# Altium project SB200BEPCBv2.PrjPCB (part 1 of 2)
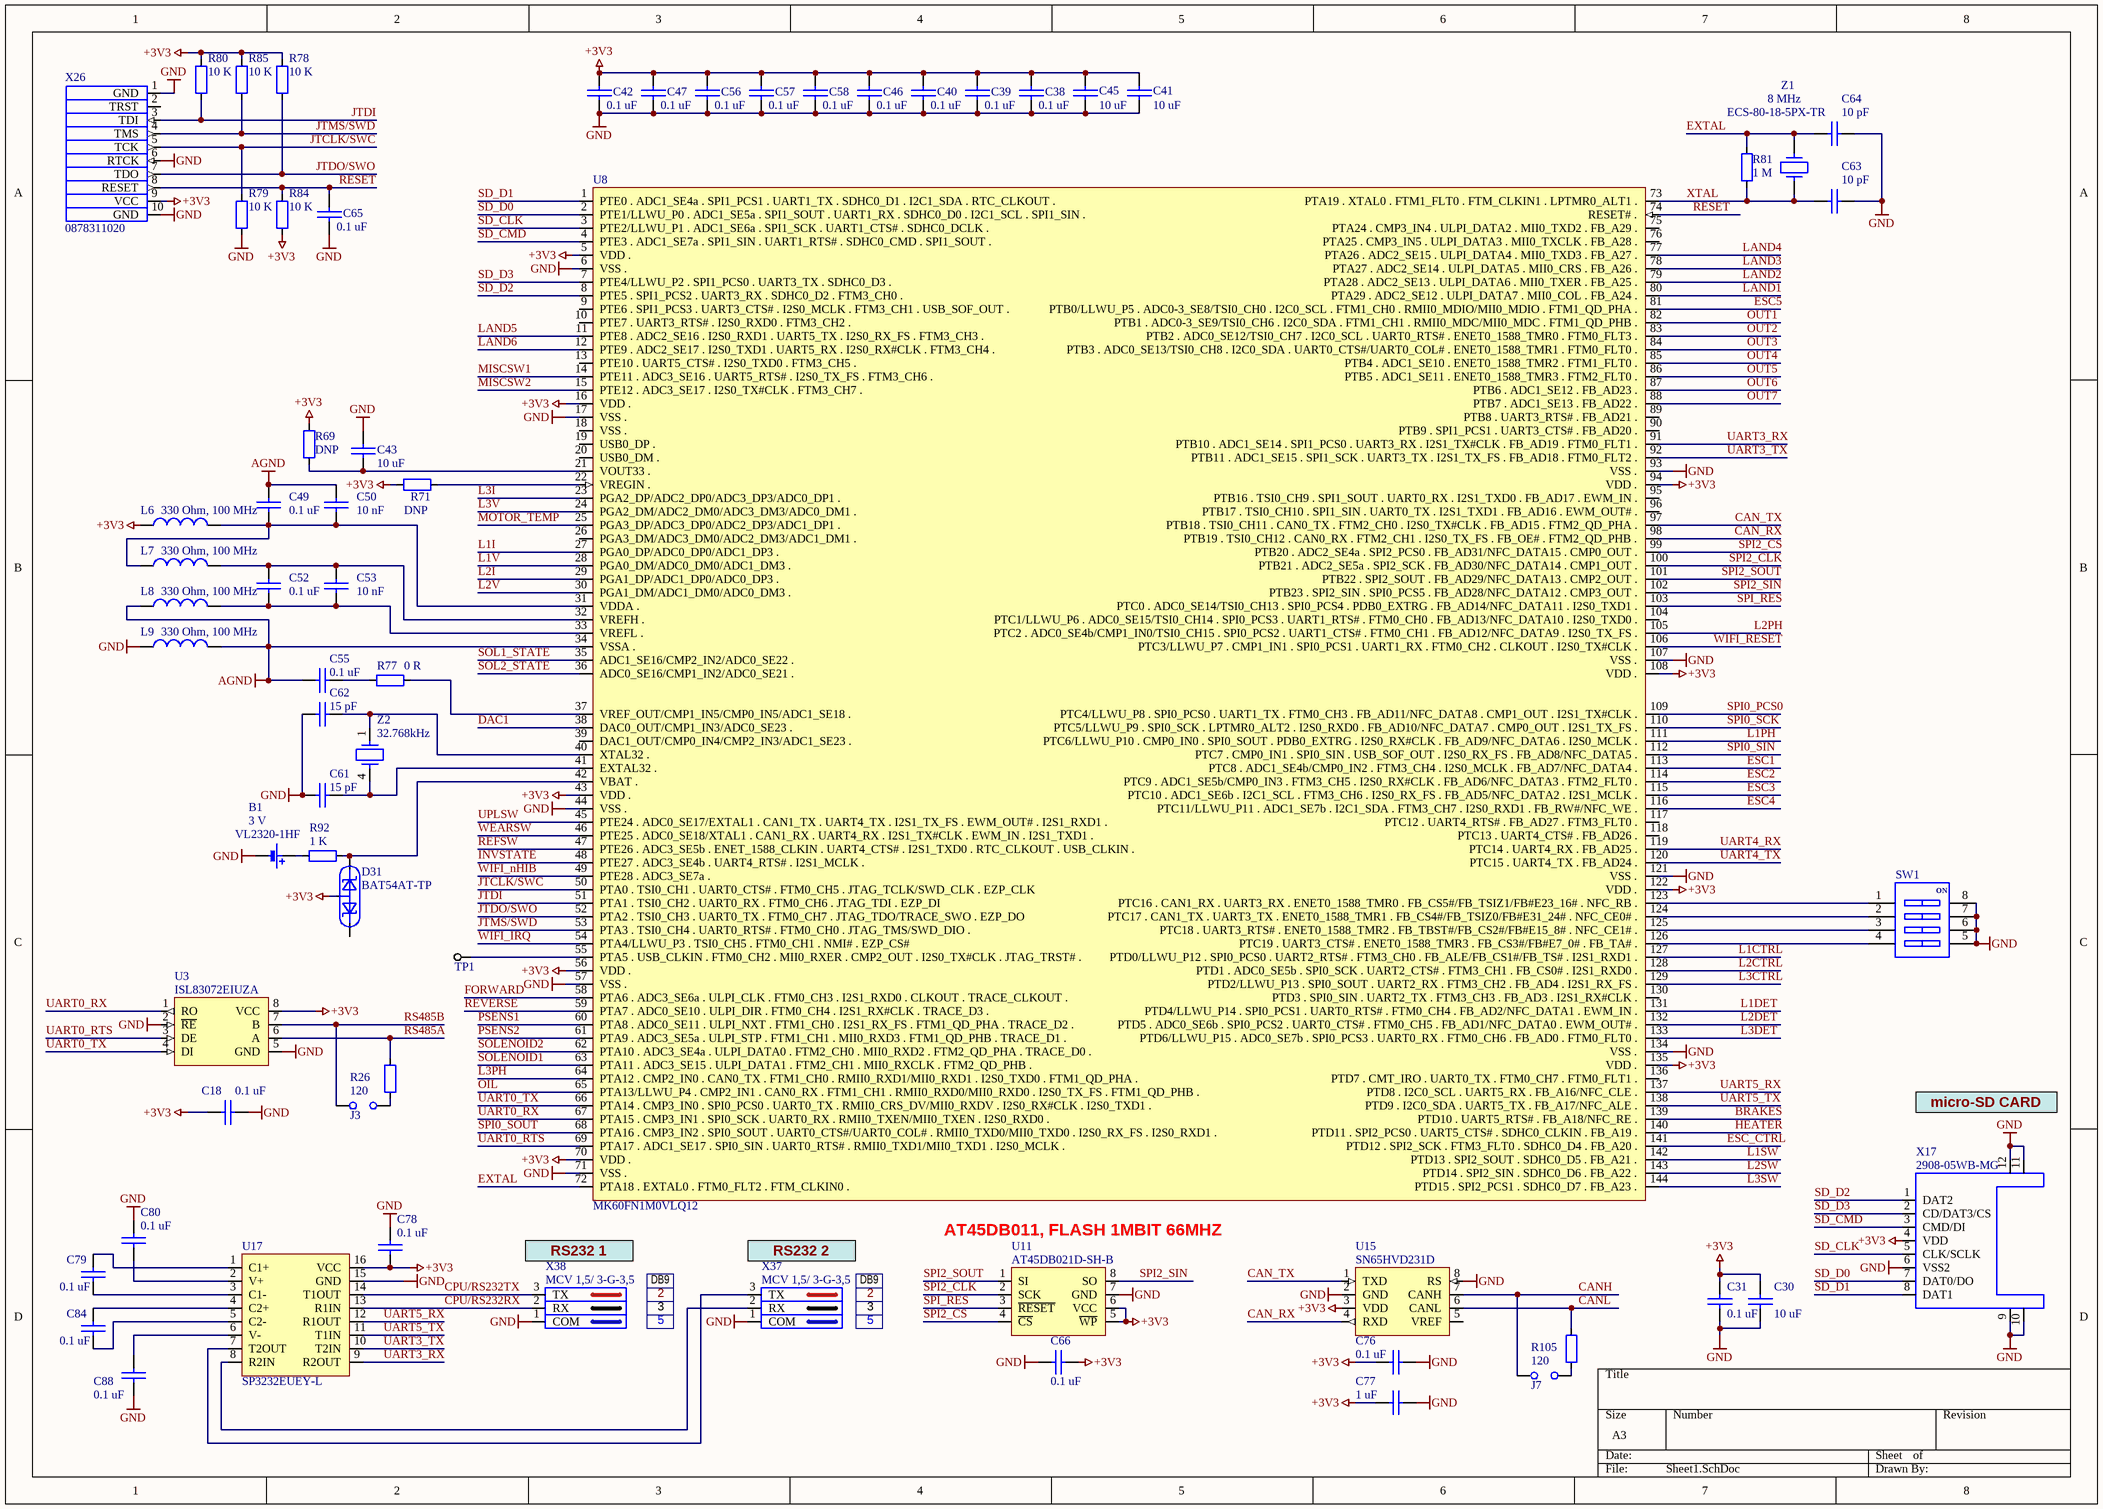
[diagram p0: Sheet1.SchDoc]
5 sheets, 378 parts. Net scope: global (net labels, ports and power ports of the same name join across sheets).
Sheets:
  Sheet1.SchDoc
  Sheet2.SchDoc
  Sheet3.SchDoc
  Sheet4.SchDoc
  Principles_of_control.SchDoc

## Sheet Sheet1.SchDoc
size A3; DocumentNumber: 1; SheetNumber: 1; SheetTotal: 4

### Parts
B1  VL2320-1HF  value 3 V  [SANYO ML2430]
C18  value 0.1 uF  [1608[0603]]  (hidden comment: CVNF100K0603-25)
C30  value 10 uF  [2012[0805]]  (hidden comment: C2012X5R1C106K085AC)
C31  value 0.1 uF  [1608[0603]]  (hidden comment: CL10B104KA8NNND)
C38  value 0.1 uF  [1608[0603]]  (hidden comment: CL10B104KA8NNND)
C39  value 0.1 uF  [1608[0603]]  (hidden comment: CL10B104KA8NNND)
C40  value 0.1 uF  [1608[0603]]  (hidden comment: CL10B104KA8NNND)
C41  value 10 uF  [2012[0805]]  (hidden comment: C2012X5R1C106K085AC)
C42  value 0.1 uF  [1608[0603]]  (hidden comment: CL10B104KA8NNND)
C43  value 10 uF  [2012[0805]]  (hidden comment: C2012X5R1C106K085AC)
C45  value 10 uF  [2012[0805]]  (hidden comment: C2012X5R1C106K085AC)
C46  value 0.1 uF  [1608[0603]]  (hidden comment: CL10B104KA8NNND)
C47  value 0.1 uF  [1608[0603]]  (hidden comment: CL10B104KA8NNND)
C49  value 0.1 uF  [1608[0603]]  (hidden comment: CL10B104KA8NNND)
C50  value 10 nF  [1608[0603]]  (hidden comment: CL10B103JB8NNNC)
C52  value 0.1 uF  [1608[0603]]  (hidden comment: CL10B104KA8NNND)
C53  value 10 nF  [1608[0603]]  (hidden comment: CL10B103JB8NNNC)
C55  value 0.1 uF  [1608[0603]]  (hidden comment: CL10B104KA8NNND)
C56  value 0.1 uF  [1608[0603]]  (hidden comment: CL10B104KA8NNND)
C57  value 0.1 uF  [1608[0603]]  (hidden comment: CL10B104KA8NNND)
C58  value 0.1 uF  [1608[0603]]  (hidden comment: CL10B104KA8NNND)
C61  value 15 pF  [1608[0603]]  (hidden comment: CC0603JRNPO9BN150)
C62  value 15 pF  [1608[0603]]  (hidden comment: CC0603JRNPO9BN150)
C63  value 10 pF  [1608[0603]]  (hidden comment: CCPF010K0603)
C64  value 10 pF  [1608[0603]]  (hidden comment: CCPF010K0603)
C65  value 0.1 uF  [1608[0603]]  (hidden comment: CL10B104KA8NNND)
C66  value 0.1 uF  [1608[0603]]  (hidden comment: CL10B104KA8NNND)
C76  value 0.1 uF  [1608[0603]]  (hidden comment: CVNF100K0603-25)
C77  value 1 uF  [1608[0603]]  (hidden comment: GRM188R60J105KA01D)
C78  value 0.1 uF  [1608[0603]]  (hidden comment: CVNF100K0603-25)
C79  value 0.1 uF  [1608[0603]]  (hidden comment: CVNF100K0603-25)
C80  value 0.1 uF  [1608[0603]]  (hidden comment: CVNF100K0603-25)
C84  value 0.1 uF  [1608[0603]]  (hidden comment: CVNF100K0603-25)
C88  value 0.1 uF  [1608[0603]]  (hidden comment: CVNF100K0603-25)
D31  BAT54AT-TP  [SOT-523F]
J3  PH1-02-TA-HT  [HDR1X2V]  (value not drawn)
J7  PH1-02-TA-HT  [HDR1X2V]  (value not drawn)
L6  value 330 Ohm, 100 MHz  [0603]  (hidden comment: BLM18SG331TN1D)
L7  value 330 Ohm, 100 MHz  [0603]  (hidden comment: BLM18SG331TN1D)
L8  value 330 Ohm, 100 MHz  [0603]  (hidden comment: BLM18SG331TN1D)
L9  value 330 Ohm, 100 MHz  [0603]  (hidden comment: BLM18SG331TN1D)
R26  value 120  [0603]  (hidden comment: RL0603E120-1)
R69  value DNP  [0603]  (hidden comment: DNP_0603)  (no BOM)
R71  value DNP  [0603]  (hidden comment: DNP_0603)  (no BOM)
R77  value 0 R  [0603]  (hidden comment: RC0603JR-070RL)
R78  value 10 K  [0603]  (hidden comment: RL0603K010-1)
R79  value 10 K  [0603]  (hidden comment: RL0603K010-1)
R80  value 10 K  [0603]  (hidden comment: RL0603K010-1)
R81  value 1 M  [0603]  (hidden comment: RC0603FR-071ML)
R84  value 10 K  [0603]  (hidden comment: RL0603K010-1)
R85  value 10 K  [0603]  (hidden comment: RL0603K010-1)
R92  value 1 K  [0603]  (hidden comment: RC0603FR-071KL)
R105  value 120  [0603]  (hidden comment: RL0603E120-1)
SW1  MCDHN-04F-T-V  [MCDHN-04F-T-V]  (value not drawn)
TP1  Test_point 0.7 мм  [Test point 0.7 мм]  (value not drawn)  (net tie, no BOM)
U3  ISL83072EIUZA  [MSOP 8]
U8  MK60FN1M0VLQ12  [LQFP144]
U11  AT45DB021D-SH-B  [SO-8  wide]
U15  SN65HVD231D  [SO-8]
U17  SP3232EUEY-L  [TSOP65P640-16AM]
X17  2908-05WB-MG  [2908-05WB-MG]
X26  0878311020  [878311020 MGRID WALL HDR SMD]
X37  MCV 1,5/ 3-G-3,5  [mcv1.5-3-g_3.5]
X38  MCV 1,5/ 3-G-3,5  [mcv1.5-3-g_3.5]
Z1  ECS-80-18-5PX-TR  value 8 MHz  [Quartz Crystal SMU4]
Z2  value 32.768kHz  [CM200S]  (hidden comment: CM200C32768DZBT)

### Nets
+3V3: C18.1 C30.1 C31.1 C38.2 C39.2 C40.2 C41.1 C42.2 C45.1 C46.2 C47.2 C56.2 C57.2 C58.2 C66.1 C76.1 C77.1 C78.1 D31.3 L6.1 R69.2 R71.1 R78.2 R80.2 R84.1 R85.2 U3.8(VCC) U8.5(VDD_.) U8.16(VDD_.) U8.43(VDD_.) U8.56(VDD_.) U8.70(VDD_.) U8.94(VDD_.) U8.108(VDD_.) U8.122(VDD_.) U8.135(VDD_.) U11.5(~{WP}) U11.6(VCC) U15.3(VDD) U17.16(VCC) X17.4(VDD) X26.9(VCC)
AGND: C49.2 C50.2 C55.2 L8.1 L9.2 U8.34(VSSA_.)
GND: B1.1 C18.2 C30.2 C31.2 C38.1 C39.1 C40.1 C41.2 C42.1 C43.2 C45.2 C46.1 C47.1 C56.1 C57.1 C58.1 C61.2 C62.2 C63.2 C64.2 C65.1 C66.2 C76.2 C77.2 C78.2 C80.1 C88.2 L9.1 R79.1 SW1.5 SW1.6 SW1.7 SW1.8 U3.2(~{RE}) U3.5(GND) U8.6(VSS_.) U8.17(VSS_.) U8.44(VSS_.) U8.57(VSS_.) U8.71(VSS_.) U8.93(VSS_.) U8.107(VSS_.) U8.121(VSS_.) U8.134(VSS_.) U11.7(GND) U15.2(GND) U15.8(RS) U17.15(GND) X17.6(VSS2) X17.9 X17.10(WP) X17.11(GND) X17.12(GND) X26.1(GND) X26.6(RTCK) X26.10(GND) X37.1(COM) X38.1(COM)
BRAKES: U8.139(PTD10_._UART5_RTS#_._FB_A18/NFC_RE_.)
CAN_RX: U8.98(PTB19_._TSI0_CH12_._CAN0_RX_._FTM2_CH1_._I2S0_TX_FS_._FB_OE#_._FTM2_QD_PHB_.) U15.4(RXD)
CAN_TX: U8.97(PTB18_._TSI0_CH11_._CAN0_TX_._FTM2_CH0_._I2S0_TX#CLK_._FB_AD15_._FTM2_QD_PHA_.) U15.1(TXD)
CANH: J7.1 U15.7(CANH)
CANL: R105.2 U15.6(CANL)
CPU/RS232RX: U17.13(R1IN) X38.2(RX)
CPU/RS232TX: U17.14(T1OUT) X38.3(TX)
DAC1: U8.38(DAC0_OUT/CMP1_IN3/ADC0_SE23_.)
ESC1: U8.113(PTC8_._ADC1_SE4b/CMP0_IN2_._FTM3_CH4_._I2S0_MCLK_._FB_AD7/NFC_DATA4_.)
ESC2: U8.114(PTC9_._ADC1_SE5b/CMP0_IN3_._FTM3_CH5_._I2S0_RX#CLK_._FB_AD6/NFC_DATA3_._FTM2_FLT0_.)
ESC3: U8.115(PTC10_._ADC1_SE6b_._I2C1_SCL_._FTM3_CH6_._I2S0_RX_FS_._FB_AD5/NFC_DATA2_._I2S1_MCLK_.)
ESC4: U8.116(PTC11/LLWU_P11_._ADC1_SE7b_._I2C1_SDA_._FTM3_CH7_._I2S0_RXD1_._FB_RW#/NFC_WE_.)
ESC5: U8.81(PTB0/LLWU_P5_._ADC0-3_SE8/TSI0_CH0_._I2C0_SCL_._FTM1_CH0_._RMII0_MDIO/MII0_MDIO_._FTM1_QD_PHA_.)
ESC_CTRL: U8.141(PTD12_._SPI2_SCK_._FTM3_FLT0_._SDHC0_D4_._FB_A20_.)
EXTAL: C64.1 R81.2 U8.72(PTA18_._EXTAL0_._FTM0_FLT2_._FTM_CLKIN0_.) Z1.2
FORWARD: U8.58(PTA6_._ADC3_SE6a_._ULPI_CLK_._FTM0_CH3_._I2S1_RXD0_._CLKOUT_._TRACE_CLKOUT_.)
HEATER: U8.140(PTD11_._SPI2_PCS0_._UART5_CTS#_._SDHC0_CLKIN_._FB_A19_.)
INVSTATE: U8.48(PTE27_._ADC3_SE4b_._UART4_RTS#_._I2S1_MCLK_.)
JTCLK/SWC: R79.2 U8.50(PTA0_._TSI0_CH1_._UART0_CTS#_._FTM0_CH5_._JTAG_TCLK/SWD_CLK_._EZP_CLK) X26.5(TCK)
JTDI: R80.1 U8.51(PTA1_._TSI0_CH2_._UART0_RX_._FTM0_CH6_._JTAG_TDI_._EZP_DI) X26.3(TDI)
JTDO/SWO: R78.1 U8.52(PTA2_._TSI0_CH3_._UART0_TX_._FTM0_CH7_._JTAG_TDO/TRACE_SWO_._EZP_DO) X26.7(TDO)
JTMS/SWD: R85.1 U8.53(PTA3_._TSI0_CH4_._UART0_RTS#_._FTM0_CH0_._JTAG_TMS/SWD_DIO_.) X26.4(TMS)
L1CTRL: U8.127(PTD0/LLWU_P12_._SPI0_PCS0_._UART2_RTS#_._FTM3_CH0_._FB_ALE/FB_CS1#/FB_TS#_._I2S1_RXD1_.)
L1DET: U8.131(PTD4/LLWU_P14_._SPI0_PCS1_._UART0_RTS#_._FTM0_CH4_._FB_AD2/NFC_DATA1_._EWM_IN_.)
L1I: U8.27(PGA0_DP/ADC0_DP0/ADC1_DP3_.)
L1PH: U8.111(PTC6/LLWU_P10_._CMP0_IN0_._SPI0_SOUT_._PDB0_EXTRG_._I2S0_RX#CLK_._FB_AD9/NFC_DATA6_._I2S0_MCLK_.)
L1SW: U8.142(PTD13_._SPI2_SOUT_._SDHC0_D5_._FB_A21_.)
L1V: U8.28(PGA0_DM/ADC0_DM0/ADC1_DM3_.)
L2CTRL: U8.128(PTD1_._ADC0_SE5b_._SPI0_SCK_._UART2_CTS#_._FTM3_CH1_._FB_CS0#_._I2S1_RXD0_.)
L2DET: U8.132(PTD5_._ADC0_SE6b_._SPI0_PCS2_._UART0_CTS#_._FTM0_CH5_._FB_AD1/NFC_DATA0_._EWM_OUT#_.)
L2I: U8.29(PGA1_DP/ADC1_DP0/ADC0_DP3_.)
L2PH: U8.105(PTC2_._ADC0_SE4b/CMP1_IN0/TSI0_CH15_._SPI0_PCS2_._UART1_CTS#_._FTM0_CH1_._FB_AD12/NFC_DATA9_._I2S0_TX_FS_.)
L2SW: U8.143(PTD14_._SPI2_SIN_._SDHC0_D6_._FB_A22_.)
L2V: U8.30(PGA1_DM/ADC1_DM0/ADC0_DM3_.)
L3CTRL: U8.129(PTD2/LLWU_P13_._SPI0_SOUT_._UART2_RX_._FTM3_CH2_._FB_AD4_._I2S1_RX_FS_.)
L3DET: U8.133(PTD6/LLWU_P15_._ADC0_SE7b_._SPI0_PCS3_._UART0_RX_._FTM0_CH6_._FB_AD0_._FTM0_FLT0_.)
L3I: U8.23(PGA2_DP/ADC2_DP0/ADC3_DP3/ADC0_DP1_.)
L3PH: U8.64(PTA12_._CMP2_IN0_._CAN0_TX_._FTM1_CH0_._RMII0_RXD1/MII0_RXD1_._I2S0_TXD0_._FTM1_QD_PHA_.)
L3SW: U8.144(PTD15_._SPI2_PCS1_._SDHC0_D7_._FB_A23_.)
L3V: U8.24(PGA2_DM/ADC2_DM0/ADC3_DM3/ADC0_DM1_.)
LAND1: U8.80(PTA29_._ADC2_SE12_._ULPI_DATA7_._MII0_COL_._FB_A24_.)
LAND2: U8.79(PTA28_._ADC2_SE13_._ULPI_DATA6_._MII0_TXER_._FB_A25_.)
LAND3: U8.78(PTA27_._ADC2_SE14_._ULPI_DATA5_._MII0_CRS_._FB_A26_.)
LAND4: U8.77(PTA26_._ADC2_SE15_._ULPI_DATA4_._MII0_TXD3_._FB_A27_.)
LAND5: U8.11(PTE8_._ADC2_SE16_._I2S0_RXD1_._UART5_TX_._I2S0_RX_FS_._FTM3_CH3_.)
LAND6: U8.12(PTE9_._ADC2_SE17_._I2S0_TXD1_._UART5_RX_._I2S0_RX#CLK_._FTM3_CH4_.)
MISCSW1: U8.14(PTE11_._ADC3_SE16_._UART5_RTS#_._I2S0_TX_FS_._FTM3_CH6_.)
MISCSW2: U8.15(PTE12_._ADC3_SE17_._I2S0_TX#CLK_._FTM3_CH7_.)
MOTOR_TEMP: U8.25(PGA3_DP/ADC3_DP0/ADC2_DP3/ADC1_DP1_.)
OIL: U8.65(PTA13/LLWU_P4_._CMP2_IN1_._CAN0_RX_._FTM1_CH1_._RMII0_RXD0/MII0_RXD0_._I2S0_TX_FS_._FTM1_QD_PHB_.)
OUT1: U8.82(PTB1_._ADC0-3_SE9/TSI0_CH6_._I2C0_SDA_._FTM1_CH1_._RMII0_MDC/MII0_MDC_._FTM1_QD_PHB_.)
OUT2: U8.83(PTB2_._ADC0_SE12/TSI0_CH7_._I2C0_SCL_._UART0_RTS#_._ENET0_1588_TMR0_._FTM0_FLT3_.)
OUT3: U8.84(PTB3_._ADC0_SE13/TSI0_CH8_._I2C0_SDA_._UART0_CTS#/UART0_COL#_._ENET0_1588_TMR1_._FTM0_FLT0_.)
OUT4: U8.85(PTB4_._ADC1_SE10_._ENET0_1588_TMR2_._FTM1_FLT0_.)
OUT5: U8.86(PTB5_._ADC1_SE11_._ENET0_1588_TMR3_._FTM2_FLT0_.)
OUT6: U8.87(PTB6_._ADC1_SE12_._FB_AD23_.)
OUT7: U8.88(PTB7_._ADC1_SE13_._FB_AD22_.)
PSENS1: U8.60(PTA8_._ADC0_SE11_._ULPI_NXT_._FTM1_CH0_._I2S1_RX_FS_._FTM1_QD_PHA_._TRACE_D2_.)
PSENS2: U8.61(PTA9_._ADC3_SE5a_._ULPI_STP_._FTM1_CH1_._MII0_RXD3_._FTM1_QD_PHB_._TRACE_D1_.)
REFSW: U8.47(PTE26_._ADC3_SE5b_._ENET_1588_CLKIN_._UART4_CTS#_._I2S1_TXD0_._RTC_CLKOUT_._USB_CLKIN_.)
RESET: C65.2 R84.2 U8.74(RESET#_.) X26.8(RESET)
REVERSE: U8.59(PTA7_._ADC0_SE10_._ULPI_DIR_._FTM0_CH4_._I2S1_RX#CLK_._TRACE_D3_.)
RS485A: R26.2 U3.6(A)
RS485B: J3.1 U3.7(B)
SD_CLK: U8.3(PTE2/LLWU_P1_._ADC1_SE6a_._SPI1_SCK_._UART1_CTS#_._SDHC0_DCLK_.) X17.5(CLK/SCLK)
SD_CMD: U8.4(PTE3_._ADC1_SE7a_._SPI1_SIN_._UART1_RTS#_._SDHC0_CMD_._SPI1_SOUT_.) X17.3(CMD/DI)
SD_D0: U8.2(PTE1/LLWU_P0_._ADC1_SE5a_._SPI1_SOUT_._UART1_RX_._SDHC0_D0_._I2C1_SCL_._SPI1_SIN_.) X17.7(DAT0/DO)
SD_D1: U8.1(PTE0_._ADC1_SE4a_._SPI1_PCS1_._UART1_TX_._SDHC0_D1_._I2C1_SDA_._RTC_CLKOUT_.) X17.8(DAT1)
SD_D2: U8.8(PTE5_._SPI1_PCS2_._UART3_RX_._SDHC0_D2_._FTM3_CH0_.) X17.1(DAT2)
SD_D3: U8.7(PTE4/LLWU_P2_._SPI1_PCS0_._UART3_TX_._SDHC0_D3_.) X17.2(CD/DAT3/CS)
SOL1_STATE: U8.35(ADC1_SE16/CMP2_IN2/ADC0_SE22_.)
SOL2_STATE: U8.36(ADC0_SE16/CMP1_IN2/ADC0_SE21_.)
SOLENOID1: U8.63(PTA11_._ADC3_SE15_._ULPI_DATA1_._FTM2_CH1_._MII0_RXCLK_._FTM2_QD_PHB_.)
SOLENOID2: U8.62(PTA10_._ADC3_SE4a_._ULPI_DATA0_._FTM2_CH0_._MII0_RXD2_._FTM2_QD_PHA_._TRACE_D0_.)
SPI0_PCS0: U8.109(PTC4/LLWU_P8_._SPI0_PCS0_._UART1_TX_._FTM0_CH3_._FB_AD11/NFC_DATA8_._CMP1_OUT_._I2S1_TX#CLK_.)
SPI0_SCK: U8.110(PTC5/LLWU_P9_._SPI0_SCK_._LPTMR0_ALT2_._I2S0_RXD0_._FB_AD10/NFC_DATA7_._CMP0_OUT_._I2S1_TX_FS_.)
SPI0_SIN: U8.112(PTC7_._CMP0_IN1_._SPI0_SIN_._USB_SOF_OUT_._I2S0_RX_FS_._FB_AD8/NFC_DATA5_.)
SPI0_SOUT: U8.68(PTA16_._CMP3_IN2_._SPI0_SOUT_._UART0_CTS#/UART0_COL#_._RMII0_TXD0/MII0_TXD0_._I2S0_RX_FS_._I2S0_RXD1_.)
SPI2_CLK: U8.100(PTB21_._ADC2_SE5a_._SPI2_SCK_._FB_AD30/NFC_DATA14_._CMP1_OUT_.) U11.2(SCK)
SPI2_CS: U8.99(PTB20_._ADC2_SE4a_._SPI2_PCS0_._FB_AD31/NFC_DATA15_._CMP0_OUT_.) U11.4(~{CS})
SPI2_SIN: U8.102(PTB23_._SPI2_SIN_._SPI0_PCS5_._FB_AD28/NFC_DATA12_._CMP3_OUT_.) U11.8(SO)
SPI2_SOUT: U8.101(PTB22_._SPI2_SOUT_._FB_AD29/NFC_DATA13_._CMP2_OUT_.) U11.1(SI)
SPI_RES: U8.103(PTC0_._ADC0_SE14/TSI0_CH13_._SPI0_PCS4_._PDB0_EXTRG_._FB_AD14/NFC_DATA11_._I2S0_TXD1_.) U11.3(~{RESET})
UART0_RTS: U3.3(DE) U8.69(PTA17_._ADC1_SE17_._SPI0_SIN_._UART0_RTS#_._RMII0_TXD1/MII0_TXD1_._I2S0_MCLK_.)
UART0_RX: U3.1(RO) U8.67(PTA15_._CMP3_IN1_._SPI0_SCK_._UART0_RX_._RMII0_TXEN/MII0_TXEN_._I2S0_RXD0_.)
UART0_TX: U3.4(DI) U8.66(PTA14_._CMP3_IN0_._SPI0_PCS0_._UART0_TX_._RMII0_CRS_DV/MII0_RXDV_._I2S0_RX#CLK_._I2S0_TXD1_.)
UART3_RX: U8.91(PTB10_._ADC1_SE14_._SPI1_PCS0_._UART3_RX_._I2S1_TX#CLK_._FB_AD19_._FTM0_FLT1_.) U17.9(R2OUT)
UART3_TX: U8.92(PTB11_._ADC1_SE15_._SPI1_SCK_._UART3_TX_._I2S1_TX_FS_._FB_AD18_._FTM0_FLT2_.) U17.10(T2IN)
UART4_RX: U8.119(PTC14_._UART4_RX_._FB_AD25_.)
UART4_TX: U8.120(PTC15_._UART4_TX_._FB_AD24_.)
UART5_RX: U8.137(PTD8_._I2C0_SCL_._UART5_RX_._FB_A16/NFC_CLE_.) U17.12(R1OUT)
UART5_TX: U8.138(PTD9_._I2C0_SDA_._UART5_TX_._FB_A17/NFC_ALE_.) U17.11(T1IN)
UPLSW: U8.45(PTE24_._ADC0_SE17/EXTAL1_._CAN1_TX_._UART4_TX_._I2S1_TX_FS_._EWM_OUT#_._I2S1_RXD1_.)
WEARSW: U8.46(PTE25_._ADC0_SE18/XTAL1_._CAN1_RX_._UART4_RX_._I2S1_TX#CLK_._EWM_IN_._I2S1_TXD1_.)
WIFI_IRQ: U8.54(PTA4/LLWU_P3_._TSI0_CH5_._FTM0_CH1_._NMI#_._EZP_CS#)
WIFI_nHIB: U8.49(PTE28_._ADC3_SE7a_.)
WIFI_RESET: U8.106(PTC3/LLWU_P7_._CMP1_IN1_._SPI0_PCS1_._UART1_RX_._FTM0_CH2_._CLKOUT_._I2S0_TX#CLK_.)
XTAL: C63.1 R81.1 U8.73(PTA19_._XTAL0_._FTM1_FLT0_._FTM_CLKIN1_._LPTMR0_ALT1_.) Z1.1
NetB1_2: B1.2 R92.2
NetC43_1: C43.1 R69.1 U8.21(VOUT33_.)
NetC49_1: C49.1 C50.1 L6.2 L7.1 U8.31(VDDA_.)
NetC52_1: C52.1 C53.1 L8.2 U8.33(VREFL_.)
NetC52_2: C52.2 C53.2 L7.2 U8.32(VREFH_.)
NetC55_1: C55.1 R77.1
NetC61_1: C61.1 U8.41(EXTAL32_.) Z2.4
NetC62_1: C62.1 U8.40(XTAL32_.) Z2.1
NetC79_1: C79.1 U17.1(C1+)
NetC79_2: C79.2 U17.3(C1-)
NetC80_2: C80.2 U17.2(V+)
NetC84_1: C84.1 U17.4(C2+)
NetC84_2: C84.2 U17.5(C2-)
NetC88_1: C88.1 U17.6(V-)
NetD31_2: D31.2 R92.1 U8.42(VBAT_.)
NetJ3_2: J3.2 R26.1
NetJ7_2: J7.2 R105.1
NetR71_2: R71.2 U8.22(VREGIN_.)
NetR77_2: R77.2 U8.37(VREF_OUT/CMP1_IN5/CMP0_IN5/ADC1_SE18_.)
NetSW1_1: SW1.1 U8.123(PTC16_._CAN1_RX_._UART3_RX_._ENET0_1588_TMR0_._FB_CS5#/FB_TSIZ1/FB#E23_16#_._NFC_RB_.)
NetSW1_2: SW1.2 U8.124(PTC17_._CAN1_TX_._UART3_TX_._ENET0_1588_TMR1_._FB_CS4#/FB_TSIZ0/FB#E31_24#_._NFC_CE0#_.)
NetSW1_3: SW1.3 U8.125(PTC18_._UART3_RTS#_._ENET0_1588_TMR2_._FB_TBST#/FB_CS2#/FB#E15_8#_._NFC_CE1#_.)
NetSW1_4: SW1.4 U8.126(PTC19_._UART3_CTS#_._ENET0_1588_TMR3_._FB_CS3#/FB#E7_0#_._FB_TA#_.)
NetTP1_1: TP1.1 U8.55(PTA5_._USB_CLKIN_._FTM0_CH2_._MII0_RXER_._CMP2_OUT_._I2S0_TX#CLK_._JTAG_TRST#_.)
NetU17_7: U17.7(T2OUT) X37.3(TX)
NetU17_8: U17.8(R2IN) X37.2(RX)

Not connected (* = marked no-connect by the designer): D31 1; U8 9(PTE6_._SPI1_PCS3_._UART3_CTS#_._I2S0_MCLK_._FTM3_CH1_._USB_SOF_OUT_.) 10(PTE7_._UART3_RTS#_._I2S0_RXD0_._FTM3_CH2_.) 13(PTE10_._UART5_CTS#_._I2S0_TXD0_._FTM3_CH5_.) 18(VSS_.) 19(USB0_DP_.) 20(USB0_DM_.) 26(PGA3_DM/ADC3_DM0/ADC2_DM3/ADC1_DM1_.) 39(DAC1_OUT/CMP0_IN4/CMP2_IN3/ADC1_SE23_.) 75(PTA24_._CMP3_IN4_._ULPI_DATA2_._MII0_TXD2_._FB_A29_.) 76(PTA25_._CMP3_IN5_._ULPI_DATA3_._MII0_TXCLK_._FB_A28_.) 89(PTB8_._UART3_RTS#_._FB_AD21_.) 90(PTB9_._SPI1_PCS1_._UART3_CTS#_._FB_AD20_.) 95(PTB16_._TSI0_CH9_._SPI1_SOUT_._UART0_RX_._I2S1_TXD0_._FB_AD17_._EWM_IN_.) 96(PTB17_._TSI0_CH10_._SPI1_SIN_._UART0_TX_._I2S1_TXD1_._FB_AD16_._EWM_OUT#_.) 104(PTC1/LLWU_P6_._ADC0_SE15/TSI0_CH14_._SPI0_PCS3_._UART1_RTS#_._FTM0_CH0_._FB_AD13/NFC_DATA10_._I2S0_TXD0_.) 117(PTC12_._UART4_RTS#_._FB_AD27_._FTM3_FLT0_.) 118(PTC13_._UART4_CTS#_._FB_AD26_.) 130(PTD3_._SPI0_SIN_._UART2_TX_._FTM3_CH3_._FB_AD3_._I2S1_RX#CLK_.) 136(PTD7_._CMT_IRO_._UART0_TX_._FTM0_CH7_._FTM0_FLT1_.); U15 5(VREF); X26 2(TRST)

### Notes on the sheet
- micro-SD CARD
- RS232 1
- RS232 2
- AT45DB011, FLASH 1MBIT 66MHZ
- DB9
- 2
- 3
- 5
- (in symbol MCDHN-04F-T-V) ON

### Library data of the parts
B1 = VL2320-1HF: Rechargeable Litium battery, Sanyo, 100 mAh, 3.1 V; PartNum: P083-ND; Manufacturer: Panasonic - BSG; Price: 5.85$; Distributor: Digi-Key; PartName: VL2320-1HF
C18 C76 C78-C80 C84 C88 = CVNF100K0603-25: 0.1 uF, 25V, 10% , X7R,  0603 SMD MLC Capacitor; Manufacturer: SAMSUNG; PartNum: CL10B104KA8NNND; Tolerance: 10%; Distributor: Future; Price: 0.0026 Euro; Voltage: 25 V; PartName: CL10B104KA8NNND
C30 C41 C43 C45 = C2012X5R1C106K/0.85: 10 uF, 16V, X5R, ±10%, 0805; Manufacturer: TDK Corporation; Distributor: Future; Price: 0.0347 Euro; Tolerance: ±10%; PartNum: C2012X5R1C106K085AC; Voltage: 16V; PartName: C2012X5R1C106K085AC
C31 C38-C40 C42 C46 C47 C49 C52 C55-C58 C65 C66 = CVNF100K0603-25: 0.1 uF, 25V, 10% , X7R,  0603 SMD MLC Capacitor; Manufacturer: SAMSUNG; Tolerance: 10%; Distributor: Future; Price: 0.0026 Euro; Voltage: 25 V; PartNum: CL10B104KA8NNND; PartName: CL10B104KA8NNND
C50 C53 = CVNF010K0603: 10 nF, 50V, 5%, X7R, 0603 SMD MLC Capacitor; Manufacturer: SAMSUNG; Tolerance: 5%; Distributor: Future; Price: 0.0045 Euro; PartNum: CL10B103JB8NNNC; Voltage: 50 V; PartName: CL10B103JB8NNNC
C61 C62 = CCPF015K0603: 15 pF, 50V, 5%, NP0, 0603 SMD MLC Capacitor; Manufacturer: YAGEO AMERICA CORPORATION; Tolerance: 5%; Price: 0.003$; Distributor: Future; PartNum: CC0603JRNPO9BN150; Voltage: 50 V; PartName: CC0603JRNPO9BN150
C63 C64 = CCPF010K0603: 10 pF, 50V, 5%, NP0, 0603 SMD MLC Capacitor; Manufacturer: Kemet; PartNum: 399-1049-1-ND; PartName: C0603C100J5GACTU; Tolerance: 5%; Price: 0.0075$; Distributor: Digi-Key; Voltage: 50 V
C77 = GRM188R60J105KA01D: 1.0 uF, 6.3V, 10%, X5R, 0603; Manufacturer: Murata Electronics North America; PartNum: 490-1550-1-ND; Tolerance: +-10%; Distributor: DigiKey; Price: 0.023$; Voltage: 6.3 V; PartName: GRM188R60J105KA01D
D31 = BAT54AT-TP: Schottky Diode, 30 V, 200 mA, common anode, SOT523; Manufacturer: Micro Commercial Co; PartNum: BAT54AT-TPDKR-ND; Distributor: Digi-Key; Price: 0.52$; PartName: BAT54AT-TP
J3 J7 = Jumper: 2 Pos. 2.54 mm Single Row Through Hole Straight Pin Header; Manufacturer: ADAM TECH; Distributor: Future; Price: 0.02 Euro; PartNum: PH1-02-TA-HT; PartName: PH1-02-TA-HT
L6-L9 = BLM18SG331TN1D: Ferrite bead, 330 Ohm, 100 MHz,  1.5 A, 0.07 Ohm; Manufacturer: Murata Electronics North America; Tolerance: 25%; Distributor: Future; Price: 0.03 Euro; PartNum: BLM18SG331TN1D; PartName: BLM18SG331TN1D
R26 R105 = RL0603E120-1: 120 R, 1%, 0603, SMD Resistor, Taped; Manufacturer: Vishay; Voltage: 75 V; Distributor: Schukat; Price: 0.002 Euro; Tolerance: 1%; PartNum: RL0603E120-1; PartName: RL0603E120-1
R69 R71 = DNP_0603: DNP, 0603; PartNum: DNP; PartName: DNP
R77 = RL0603E000: 0 R, 5%, 0603, SMD Resistor, Taped; Manufacturer: YAGEO AMERICA CORPORATION; Voltage: 75 V; Distributor: Future; Price: 0.0017$; Tolerance: 5%; PartNum: RC0603JR-070RL; PartName: RC0603JR-070RL
R78-R80 R84 R85 = RL0603K010-1: 10 K, 1%, 0603, SMD Resistor, Taped; Manufacturer: Vishay Dale; PartNum: 541-10KGCT-ND; PartName: CRCW060310K0JNEA; Voltage: 75 V; Distributor: Digi-Key; Price: 0.016$; Tolerance: 1%
R81 = RC0603FR-071ML: 1 M, 1%, 0603, SMD Resistor, Taped; Manufacturer: YAGEO AMERICA CORPORATION; Voltage: 75 V; Distributor: Future; Price: 0.002 Euro; Tolerance: 1%; PartNum: RC0603FR-071ML; PartName: RC0603FR-071ML
R92 = RL0603K001-1: 1 K, 1%, 0603, SMD Resistor, Taped; Manufacturer: YAGEO AMERICA CORPORATION; Voltage: 75 V; Distributor: Future; Price: 0.0017$; Tolerance: 1%; PartNum: RC0603FR-071KL; PartName: RC0603FR-071KL
SW1 = MCDHN-04F-T-V: SWITCH, DIP, SMD, 4 WAY, 1.27mm; Manufacturer: MULTICOMP; PartNum: 1605479; Distributor: Farnell; Price: 0.69 Euro; PartName: 1605479
U3 = ISL3178EIUZ: RS485/422 Transc. 3..3.6V  , -40..+85 C,10-MSOP; Manufacturer: Intersil; PartNum: ISL83072EIUZA-TCT-ND; Price: 1.83$; Distributor: Digi-Key; PartName: ISL83072EIUZA
U8 = MK60FN1M0VLQ12: MK60 Series 32 Bit 1 MB Flash 128 KB Ram 120 Mhz Microcontroller - LQFP-144; Manufacturer: Freescale; Distributor: Future; PartNum: MK60FN1M0VLQ12; Price: 8.45 Euro; PartName: MK60FN1M0VLQ12
U11 = AT45DB011D-SH-T: IC DATAFLASH 1MBIT 2.7 V ~ 3.6 V 8-SOIC; Manufacturer: Adesto Technologies; PartNum: 1265-1033-1-ND; Price: 0.8$; Distributor: Digi-Key; PartName: AT45DB021D-SH-B
U15 = SN65HVD231D: 3.3-V CAN TRANSCEIVERS SO-8; Manufacturer: Texas Instruments; PartNum: 296-12206-5-ND; Price: 4.2$; Distributor: Digi-Key; PartName: SN65HVD231D
U17 = SP3232EUEY-L: IC TXRX RS232 ESD TRUE, 1 Mbps, -40+85C, 16TSSOP; Manufacturer: Exar Corporation; PartNum: 1016-1510-5-ND; Distributor: Digi-Key; Price: 1.5$; PartName: SP3232EUEY-L
X17 = 2908-05WB-MG: microSD cadr holder; Manufacturer: Amphenol Commercial Products; PartNum: 101-00660-68-6-1-ND; PartName: 101-00660-68-6; Price: 1.97$; Distributor: Digi-Key
X26 = 0878321020: JTAG, CONN HEADER 10POS 2MM VERT SMD; Manufacturer: Molex Inc; PartNum: WM18639-ND; Distributor: Digi-Key; Price: 1.29$; PartName: 0878321020
X37 X38 = MCV1.5/3-G-3.5: Header, 8 A, 160 V, 3.5 mm pitch, 3 pos; Manufacturer: Phoenix Contact; PartNum: 1843619; Distributor: Phoenix Contact; Price: 0.32 Euro; PartName: MCV 1,5/ 3-G-3,5
Z1 = ECS-80-18-5PX-TR: 8 MHz, CSM-7 Case Series, SMD, Low Profile, Load Capacitance 18pF  ,Operating Temperature -10°C ~ 70°C; Manufacturer: ECS Inc.; PartNum: XC1271CT-ND; Distributor: Digi-Key; Price: 0.61$; PartName: ECS-80-18-5PX-TR
Z2 = MC306-32,768: Crystal 32.768 kHz ±20 ppm 6 pF -40 to +85 °C SMT Tuning Fork Crystal; Manufacturer: CITIZEN FINETECH MIYOTA; Tolerance: 20 ppm; PartNum: CM200C32768DZBT; Price: 0.1956 Euro; Distributor: Future; PartName: CM200C32768DZBT

## Sheet Sheet2.SchDoc
size A3; DocumentNumber: 2; SheetNumber: 2; SheetTotal: 4
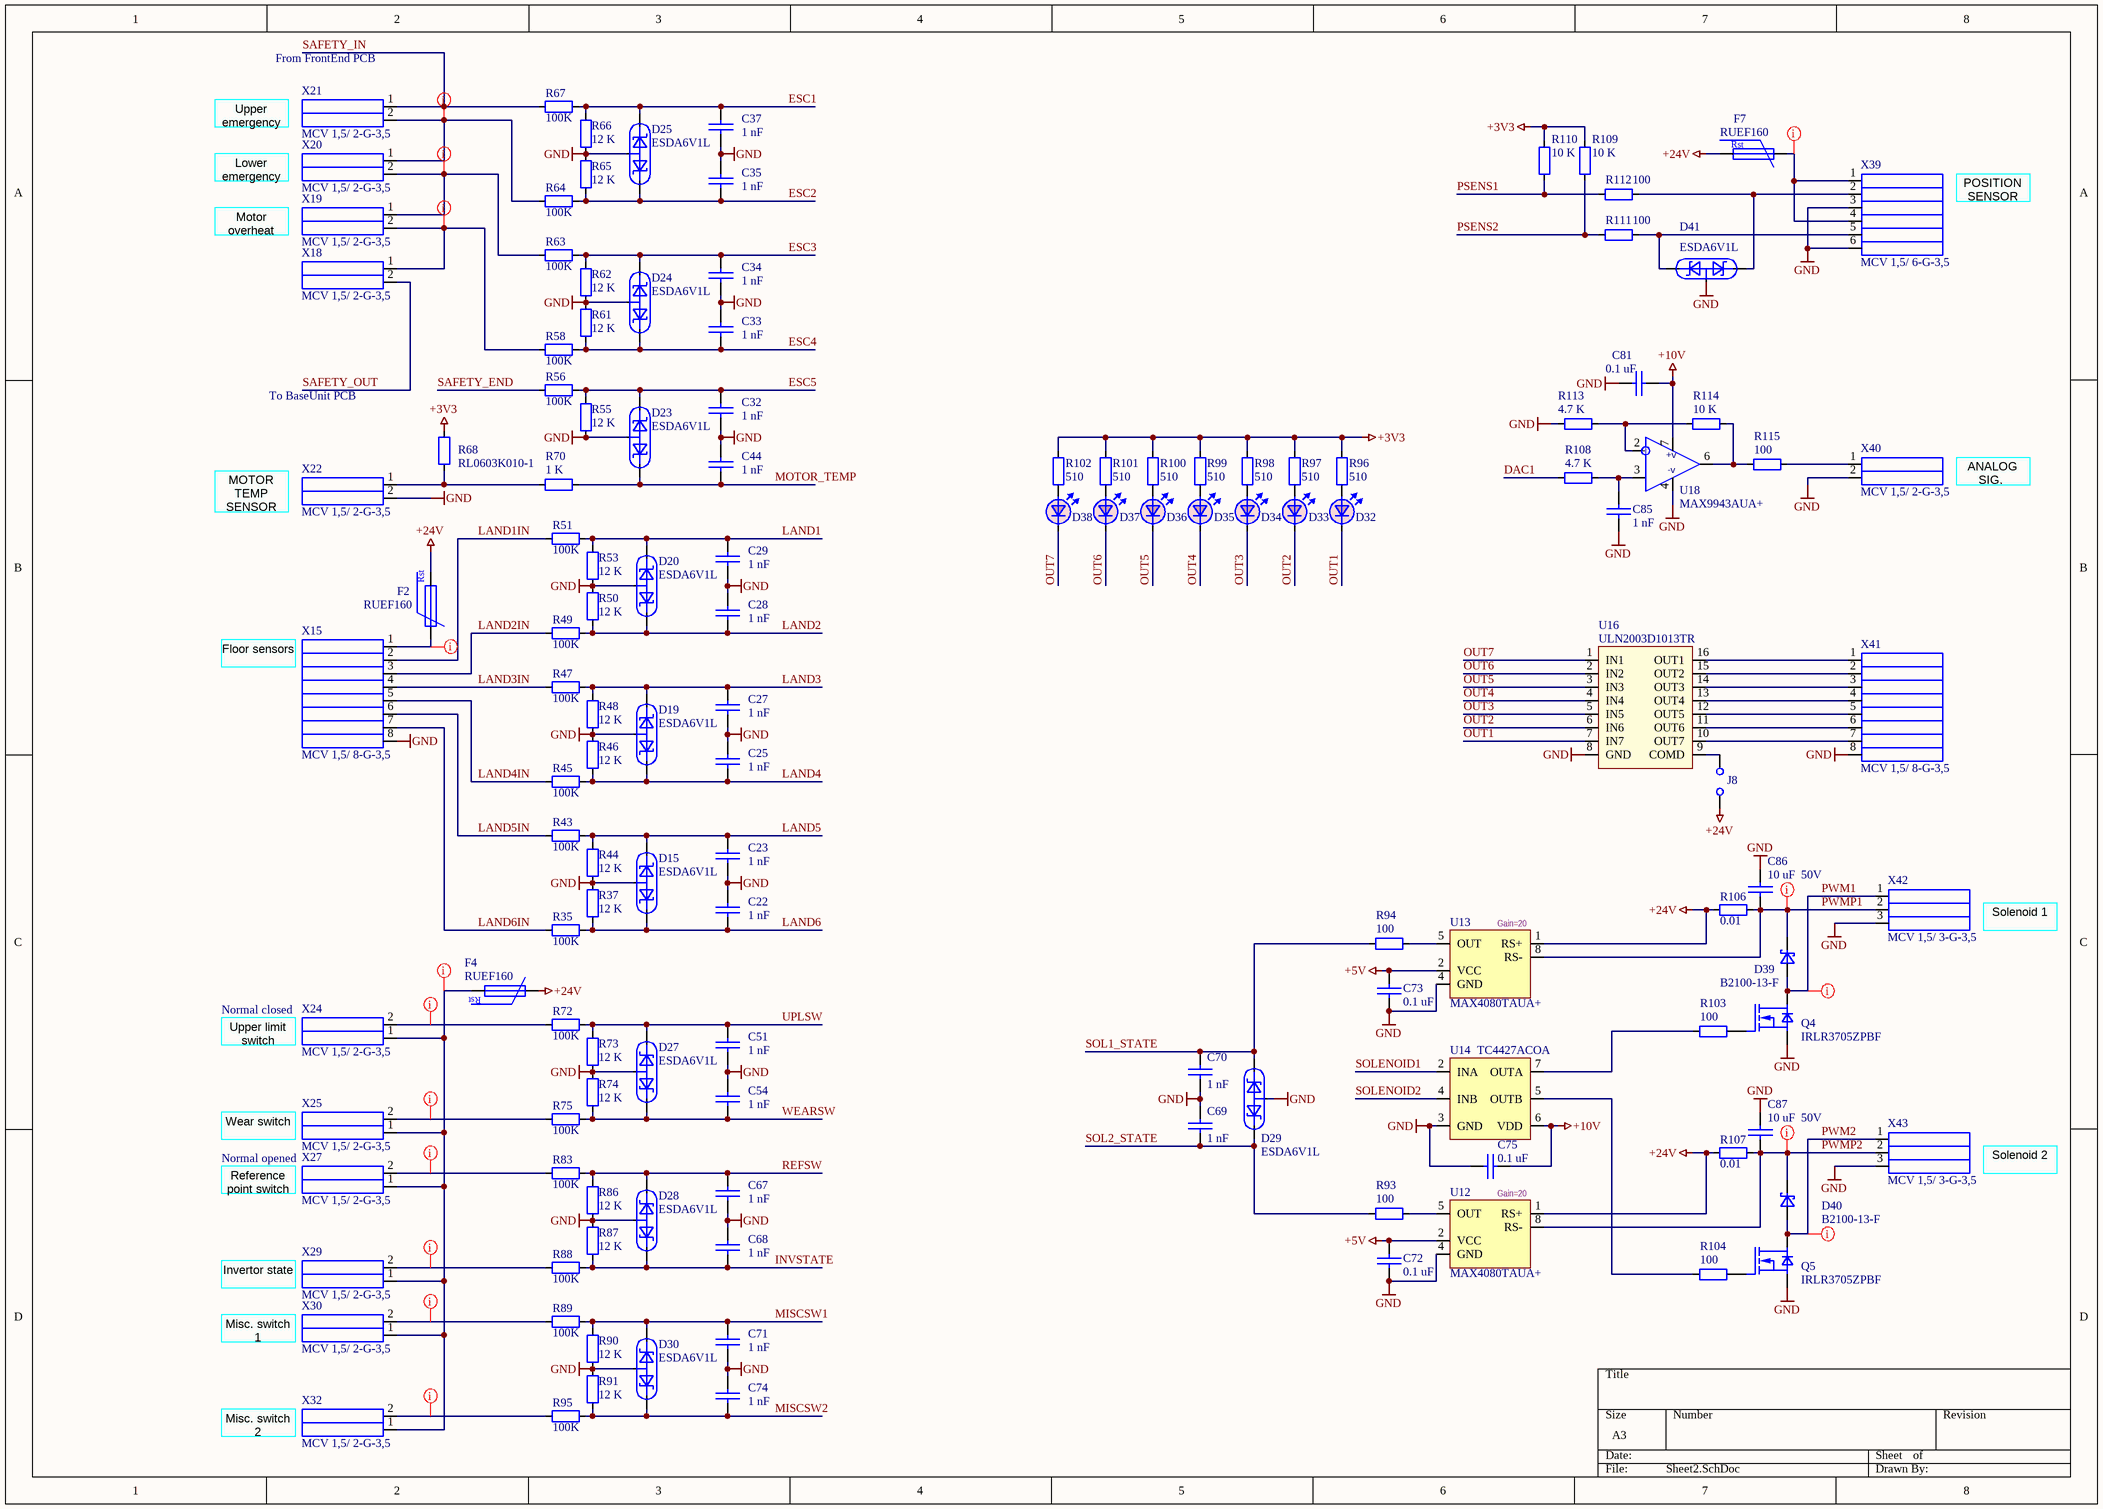
[diagram p1: Sheet2.SchDoc]

### Parts
C22  value 1 nF  [1608[0603]]  (hidden comment: CVNF1.0K0603)
C23  value 1 nF  [1608[0603]]  (hidden comment: CVNF1.0K0603)
C25  value 1 nF  [1608[0603]]  (hidden comment: CVNF1.0K0603)
C27  value 1 nF  [1608[0603]]  (hidden comment: CVNF1.0K0603)
C28  value 1 nF  [1608[0603]]  (hidden comment: CVNF1.0K0603)
C29  value 1 nF  [1608[0603]]  (hidden comment: CVNF1.0K0603)
C32  value 1 nF  [1608[0603]]  (hidden comment: CVNF1.0K0603)
C33  value 1 nF  [1608[0603]]  (hidden comment: CVNF1.0K0603)
C34  value 1 nF  [1608[0603]]  (hidden comment: CVNF1.0K0603)
C35  value 1 nF  [1608[0603]]  (hidden comment: CVNF1.0K0603)
C37  value 1 nF  [1608[0603]]  (hidden comment: CVNF1.0K0603)
C44  value 1 nF  [1608[0603]]  (hidden comment: CVNF1.0K0603)
C51  value 1 nF  [1608[0603]]  (hidden comment: CVNF1.0K0603)
C54  value 1 nF  [1608[0603]]  (hidden comment: CVNF1.0K0603)
C67  value 1 nF  [1608[0603]]  (hidden comment: CVNF1.0K0603)
C68  value 1 nF  [1608[0603]]  (hidden comment: CVNF1.0K0603)
C69  value 1 nF  [1608[0603]]  (hidden comment: CVNF1.0K0603)
C70  value 1 nF  [1608[0603]]  (hidden comment: CVNF1.0K0603)
C71  value 1 nF  [1608[0603]]  (hidden comment: CVNF1.0K0603)
C72  value 0.1 uF  [1608[0603]]  (hidden comment: CVNF100K0603-25)
C73  value 0.1 uF  [1608[0603]]  (hidden comment: CVNF100K0603-25)
C74  value 1 nF  [1608[0603]]  (hidden comment: CVNF1.0K0603)
C75  value 0.1 uF  [1608[0603]]  (hidden comment: CVNF100K0603-25)
C81  value 0.1 uF  [1608[0603]]  (hidden comment: CVNF100K0603-25)
C85  value 1 nF  [1608[0603]]  (hidden comment: CVNF1.0K0603)
C86  value 10 uF  Voltage: 50V  [3225[1210]]  (hidden comment: GRM32DF51H106ZA01L)
C87  value 10 uF  Voltage: 50V  [3225[1210]]  (hidden comment: GRM32DF51H106ZA01L)
D15  ESDA6V1L  [SOT23]
D19  ESDA6V1L  [SOT23]
D20  ESDA6V1L  [SOT23]
D23  ESDA6V1L  [SOT23]
D24  ESDA6V1L  [SOT23]
D25  ESDA6V1L  [SOT23]
D27  ESDA6V1L  [SOT23]
D28  ESDA6V1L  [SOT23]
D29  ESDA6V1L  [SOT23]
D30  ESDA6V1L  [SOT23]
D32  SML-211UTT86  [0805 LED]  (value not drawn)
D33  SML-211UTT86  [0805 LED]  (value not drawn)
D34  SML-211UTT86  [0805 LED]  (value not drawn)
D35  SML-211UTT86  [0805 LED]  (value not drawn)
D36  SML-211UTT86  [0805 LED]  (value not drawn)
D37  SML-211UTT86  [0805 LED]  (value not drawn)
D38  SML-211UTT86  [0805 LED]  (value not drawn)
D39  B2100-13-F  [SMB ST]
D40  B2100-13-F  [SMB ST]
D41  ESDA6V1L  [SOT23]
F2  RUEF160  [RUE160]
F4  RUEF160  [RUE160]
F7  RUEF160  [RUE160]
J8  PH1-02-TA-HT  [HDR1X2V]  (value not drawn)
Q4  IRLR3705ZPBF  [DPAK TO-252]
Q5  IRLR3705ZPBF  [DPAK TO-252]
R35  value 100K  [3216[1206]]  (hidden comment: ERJ-8ENF1003V)
R37  value 12 K  [0603]  (hidden comment: RL0603K012-1)
R43  value 100K  [3216[1206]]  (hidden comment: ERJ-8ENF1003V)
R44  value 12 K  [0603]  (hidden comment: RL0603K012-1)
R45  value 100K  [3216[1206]]  (hidden comment: ERJ-8ENF1003V)
R46  value 12 K  [0603]  (hidden comment: RL0603K012-1)
R47  value 100K  [3216[1206]]  (hidden comment: ERJ-8ENF1003V)
R48  value 12 K  [0603]  (hidden comment: RL0603K012-1)
R49  value 100K  [3216[1206]]  (hidden comment: ERJ-8ENF1003V)
R50  value 12 K  [0603]  (hidden comment: RL0603K012-1)
R51  value 100K  [3216[1206]]  (hidden comment: ERJ-8ENF1003V)
R53  value 12 K  [0603]  (hidden comment: RL0603K012-1)
R55  value 12 K  [0603]  (hidden comment: RL0603K012-1)
R56  value 100K  [3216[1206]]  (hidden comment: ERJ-8ENF1003V)
R58  value 100K  [3216[1206]]  (hidden comment: ERJ-8ENF1003V)
R61  value 12 K  [0603]  (hidden comment: RL0603K012-1)
R62  value 12 K  [0603]  (hidden comment: RL0603K012-1)
R63  value 100K  [3216[1206]]  (hidden comment: ERJ-8ENF1003V)
R64  value 100K  [3216[1206]]  (hidden comment: ERJ-8ENF1003V)
R65  value 12 K  [0603]  (hidden comment: RL0603K012-1)
R66  value 12 K  [0603]  (hidden comment: RL0603K012-1)
R67  value 100K  [3216[1206]]  (hidden comment: ERJ-8ENF1003V)
R68  RL0603K010-1  [0603]
R70  value 1 K  [0603]  (hidden comment: RC0603FR-071KL)
R72  value 100K  [3216[1206]]  (hidden comment: ERJ-8ENF1003V)
R73  value 12 K  [0603]  (hidden comment: RL0603K012-1)
R74  value 12 K  [0603]  (hidden comment: RL0603K012-1)
R75  value 100K  [3216[1206]]  (hidden comment: ERJ-8ENF1003V)
R83  value 100K  [3216[1206]]  (hidden comment: ERJ-8ENF1003V)
R86  value 12 K  [0603]  (hidden comment: RL0603K012-1)
R87  value 12 K  [0603]  (hidden comment: RL0603K012-1)
R88  value 100K  [3216[1206]]  (hidden comment: ERJ-8ENF1003V)
R89  value 100K  [3216[1206]]  (hidden comment: ERJ-8ENF1003V)
R90  value 12 K  [0603]  (hidden comment: RL0603K012-1)
R91  value 12 K  [0603]  (hidden comment: RL0603K012-1)
R93  value 100  [0603]  (hidden comment: ERJ-3EKF1000V)
R94  value 100  [0603]  (hidden comment: ERJ-3EKF1000V)
R95  value 100K  [3216[1206]]  (hidden comment: ERJ-8ENF1003V)
R96  value 510  [0603]  (hidden comment: RL0603E510-1)
R97  value 510  [0603]  (hidden comment: RL0603E510-1)
R98  value 510  [0603]  (hidden comment: RL0603E510-1)
R99  value 510  [0603]  (hidden comment: RL0603E510-1)
R100  value 510  [0603]  (hidden comment: RL0603E510-1)
R101  value 510  [0603]  (hidden comment: RL0603E510-1)
R102  value 510  [0603]  (hidden comment: RL0603E510-1)
R103  value 100  [0603]  (hidden comment: ERJ-3EKF1000V)
R104  value 100  [0603]  (hidden comment: ERJ-3EKF1000V)
R106  value 0.01  [MCS3264]  (hidden comment: MCS3264R010FER)
R107  value 0.01  [MCS3264]  (hidden comment: MCS3264R010FER)
R108  value 4.7 K  [0603]  (hidden comment: RL0603K004.7-1)
R109  value 10 K  [0603]  (hidden comment: RL0603K010-1)
R110  value 10 K  [0603]  (hidden comment: RL0603K010-1)
R111  value 100  [0603]  (hidden comment: ERJ-3EKF1000V)
R112  value 100  [0603]  (hidden comment: ERJ-3EKF1000V)
R113  value 4.7 K  [0603]  (hidden comment: RL0603K004.7-1)
R114  value 10 K  [0603]  (hidden comment: RL0603K010-1)
R115  value 100  [0603]  (hidden comment: ERJ-3EKF1000V)
U12  MAX4080TAUA+  [MSOP 8]
U13  MAX4080TAUA+  [MSOP 8]
U14  TC4427ACOA  [SO-8]
U16  ULN2003D1013TR  [SO-16]
U18  MAX9943AUA+  [TSSOP-8]
X15  MCV 1,5/ 8-G-3,5  [mcv1.5-8-g_3.5]
X18  MCV 1,5/ 2-G-3,5  [mcv1.5-2-g_3.5]
X19  MCV 1,5/ 2-G-3,5  [mcv1.5-2-g_3.5]
X20  MCV 1,5/ 2-G-3,5  [mcv1.5-2-g_3.5]
X21  MCV 1,5/ 2-G-3,5  [mcv1.5-2-g_3.5]
X22  MCV 1,5/ 2-G-3,5  [mcv1.5-2-g_3.5]
X24  MCV 1,5/ 2-G-3,5  [mcv1.5-2-g_3.5]
X25  MCV 1,5/ 2-G-3,5  [mcv1.5-2-g_3.5]
X27  MCV 1,5/ 2-G-3,5  [mcv1.5-2-g_3.5]
X29  MCV 1,5/ 2-G-3,5  [mcv1.5-2-g_3.5]
X30  MCV 1,5/ 2-G-3,5  [mcv1.5-2-g_3.5]
X32  MCV 1,5/ 2-G-3,5  [mcv1.5-2-g_3.5]
X39  MCV 1,5/ 6-G-3,5  [mcv1.5-6-g_3.5]
X40  MCV 1,5/ 2-G-3,5  [mcv1.5-2-g_3.5]
X41  MCV 1,5/ 8-G-3,5  [mcv1.5-8-g_3.5]
X42  MCV 1,5/ 3-G-3,5  [mcv1.5-3-g_3.5]
X43  MCV 1,5/ 3-G-3,5  [mcv1.5-3-g_3.5]

### Nets
+3V3: R68.1 R96.2 R97.2 R98.2 R99.2 R100.2 R101.2 R102.2 R109.2 R110.2
+5V: C72.2 C73.2 U12.2(VCC) U13.2(VCC)
+10V: C75.2 C81.2 U14.6(VDD) U18.7(V+)
+24V: F2.2 F4.1 F7.2 J8.1 R106.2 R107.2 U12.1(RS+) U13.1(RS+)
GND: C22.1 C23.2 C25.1 C27.2 C28.1 C29.2 C32.2 C33.1 C34.2 C35.1 C37.2 C44.1 C51.2 C54.1 C67.2 C68.1 C69.1 C70.2 C71.2 C72.1 C73.1 C74.1 C75.1 C81.1 C85.2 C86.1 C87.1 D15.3 D19.3 D20.3 D23.3 D24.3 D25.3 D27.3 D28.3 D29.3 D30.3 D41.3 Q4.3(S) Q5.3(S) R37.2 R44.1 R46.2 R48.1 R50.2 R53.1 R55.1 R61.2 R62.1 R65.2 R66.1 R73.1 R74.2 R86.1 R87.2 R90.1 R91.2 R113.2 U12.4(GND) U13.4(GND) U14.3(GND) U16.8(GND) U18.4(GND) X15.8 X22.2 X39.3 X39.6 X40.2 X41.8 X42.3(-) X43.3(-)
DAC1: R108.2
ESC1: C37.1 D25.2 R66.2 R67.2
ESC2: C35.2 D25.1 R64.2 R65.1
ESC3: C34.1 D24.2 R62.2 R63.2
ESC4: C33.2 D24.1 R58.2 R61.1
ESC5: C32.1 D23.2 R55.2 R56.2
INVSTATE: C68.2 D28.2 R87.1 R88.2
LAND1: C29.1 D20.2 R51.2 R53.2
LAND1IN: R51.1 X15.2
LAND2: C28.2 D20.1 R49.2 R50.1
LAND2IN: R49.1 X15.3
LAND3: C27.1 D19.2 R47.2 R48.2
LAND3IN: R47.1 X15.4
LAND4: C25.2 D19.1 R45.2 R46.1
LAND4IN: R45.1 X15.5
LAND5: C23.1 D15.2 R43.2 R44.2
LAND5IN: R43.1 X15.6
LAND6: C22.2 D15.1 R35.2 R37.1
LAND6IN: R35.1 X15.7
MISCSW1: C71.1 D30.1 R89.2 R90.2
MISCSW2: C74.2 D30.2 R91.1 R95.2
MOTOR_TEMP: C44.2 D23.1 R70.2
OUT1: D32.2 U16.7(IN7)
OUT2: D33.2 U16.6(IN6)
OUT3: D34.2 U16.5(IN5)
OUT4: D35.2 U16.4(IN4)
OUT5: D36.2 U16.3(IN3)
OUT6: D37.2 U16.2(IN2)
OUT7: D38.2 U16.1(IN1)
PSENS1: R110.1 R112.1
PSENS2: R109.1 R111.1
PWM1: D39.1(A) Q4.4(D) X42.1(-)
PWM2: D40.1(A) Q5.4(D) X43.1(-)
PWMP1: C86.2 D39.2(C) R106.1 U13.8(RS-) X42.2(-)
PWMP2: C87.2 D40.2(C) R107.1 U12.8(RS-) X43.2(-)
REFSW: C67.1 D28.1 R83.2 R86.2
SAFETY_END: R56.1
SAFETY_IN: R67.1 X21.1
SAFETY_OUT: X18.2
SOL1_STATE: C70.1 D29.2 R94.1
SOL2_STATE: C69.2 D29.1 R93.1
SOLENOID1: U14.2(INA)
SOLENOID2: U14.4(INB)
UPLSW: C51.1 D27.1 R72.2 R73.2
WEARSW: C54.2 D27.2 R74.1 R75.2
NetC85_1: C85.1 R108.1 U18.3(IN+)
NetD32_1: D32.1 R96.1
NetD33_1: D33.1 R97.1
NetD34_1: D34.1 R98.1
NetD35_1: D35.1 R99.1
NetD36_1: D36.1 R100.1
NetD37_1: D37.1 R101.1
NetD38_1: D38.1 R102.1
NetD41_1: D41.1 R111.2 X39.5
NetD41_2: D41.2 R112.2 X39.2
NetF2_1: F2.1 X15.1
NetF4_2: F4.2 X24.1 X25.1 X27.1 X29.1 X30.1 X32.1
NetF7_1: F7.1 X39.1 X39.4
NetJ8_2: J8.2 U16.9(COMD)
NetQ4_1: Q4.1(G) R103.2
NetQ5_1: Q5.1(G) R104.2
NetR58_1: R58.1 X18.1 X19.2
NetR63_1: R63.1 X19.1 X20.2
NetR64_1: R64.1 X20.1 X21.2
NetR68_2: R68.2 R70.1 X22.1
NetR72_1: R72.1 X24.2
NetR75_1: R75.1 X25.2
NetR83_1: R83.1 X27.2
NetR88_1: R88.1 X29.2
NetR89_1: R89.1 X30.2
NetR93_2: R93.2 U12.5(OUT)
NetR94_2: R94.2 U13.5(OUT)
NetR95_1: R95.1 X32.2
NetR103_1: R103.1 U14.7(OUTA)
NetR104_1: R104.1 U14.5(OUTB)
NetR113_1: R113.1 R114.1 U18.2(IN-)
NetR114_2: R114.2 R115.1 U18.6(OUT)
NetR115_2: R115.2 X40.1
NetU16_10: U16.10(OUT7) X41.7
NetU16_11: U16.11(OUT6) X41.6
NetU16_12: U16.12(OUT5) X41.5
NetU16_13: U16.13(OUT4) X41.4
NetU16_14: U16.14(OUT3) X41.3
NetU16_15: U16.15(OUT2) X41.2
NetU16_16: U16.16(OUT1) X41.1

### Layout directives
net class 24V: NetF2_1, NetF4_2, NetF7_1, NetR58_1, NetR63_1, NetR64_1, NetR72_1, NetR75_1, NetR83_1, NetR88_1, NetR89_1, NetR95_1, PWM1, PWM2, PWMP1, PWMP2

### Notes on the sheet
- (near X21) From FrontEnd PCB
- Upper emergency limit switch
- Lower emergency limit switch
- Motor overheat
- POSITION SENSOR
- To BaseUnit PCB
- MOTOR TEMP SENSOR
  NTC 10K B57703M0103G040
- ANALOG SIG.
  TO INVERTOR
- Floor sensors
- (near U13) Gain=20
- Solenoid 1
- Normal closed
- Upper limit switch
- Normal opened
- Wear switch
- Reference point switch
- Solenoid 2
- Gain=20
- Invertor state
- Misc. switch 1
- Misc. switch 2
- (in symbol MAX9943AUA+) +v; -v
- (in symbol RUEF160) Rst

### Library data of the parts
C22 C23 C25 C27-C29 C32-C35 C37 C44 C51 C54 C67-C71 C74 C85 = CVNF1.0K0603: 1 nF, 50V, 10%, X7R, 0603 SMD MLC Capacitor; Manufacturer: Darfon; PartNum: CL10B102KB8NNNC; Tolerance: +-10%; Distributor: Schukat; Price: 0.0047 Euro; Voltage: 50 V; PartName: CL10B102KB8NNNC
C72 C73 C75 C81 = CVNF100K0603-25: as C18 on sheet Sheet1; Tolerance: 10%; Distributor: Future; Price: 0.0026 Euro; Voltage: 25 V; PartName: CL10B104KA8NNND
C86 C87 = GRM32DF51H106ZA01L: 10uF, 50V, 20%, Y5V (F), 1210; Manufacturer: Taiyo Yuden; PartNum: 587-2225-2-ND; PartName: UMK325BJ106MM-T; Tolerance: 20%; Price: 0.16$; Distributor: Digi-Key
D15 D19 D20 D23-D25 D27-D30 D41 = ESDA6V1L: Dual transil array for ESD, 6.1 V, 300 W; Manufacturer: Micro Commercial Co; PartNum: ESDA6V1L-TPCT-ND; PartName: ESDA6V1L-TP; Distributor: Digi-Key; Price: 0.23$
D32-D38 = SML-211UTT86: 0805 red LED, hibright, 2 mA, 1.8V, 130°; Manufacturer: Rohm; PartNum: 511-1292-1-ND; Distributor: Digi-Key; Price: 0.34$; Value: Red; PartName: SML-211UTT86
D39 D40 = B2100-13-F: DIODE SCHOTTKY 100V 2A SMB; Manufacturer: Diodes Inc; PartNum: B2100-FDICT-ND; Price: 0.31$; Distributor: Digi-Key; PartName: B2100-13-F
F2 F4 F7 = RUEF160: RUEF160 - POLYSWITCH, RADIAL, 1.6A; Manufacturer: RAYCHEM; PartNum: RUEF160-ND; Distributor: Digi-Key; Price: 0.33$; PartName: RUEF160
J8 = Jumper: as J3 on sheet Sheet1; Distributor: Future; Price: 0.02 Euro; PartNum: PH1-02-TA-HT; PartName: PH1-02-TA-HT
Q4 Q5 = IRLR3705ZPBF: MOSFET N-CH 55V 42A DPAK; Manufacturer: International Rectifier; PartNum: IRLR3705ZPBF-ND; Distributor: Digi-Key; Price: 1$; PartName: IRLR3705ZPBF
R35 R43 R45 R47 R49 R51 R56 R58 R63 R64 R67 R72 R75 R83 R88 R89 R95 = CRCW1206100KFKEA: 100K, 1%,  1206,  200v,  SMD 1206; Manufacturer: Panasonic; Distributor: Future; Price: 0.0036Euro; Tolerance: 1%; Voltage: 200V; PartNum: ERJ-8ENF1003V; PartName: ERJ-8ENF1003V
R37 R44 R46 R48 R50 R53 R55 R61 R62 R65 R66 R73 R74 R86 R87 R90 R91 = RL0603K012-1: 12 K, 1%, 0603, SMD Resistor, Taped; Manufacturer: Vishay; Voltage: 75 V; Distributor: Schukat; Price: 0.002 Euro; Tolerance: 1%; PartNum: RL0603K012-1; PartName: RL0603K012-1
R68 = RL0603K010-1: 10 K, 1%, 0603, SMD Resistor, Taped; Manufacturer: Vishay Dale; PartNum: 541-10KGCT-ND; PartName: CRCW060310K0JNEA; Value: 10 K; Voltage: 75 V; Distributor: Digi-Key; Price: 0.016$; Tolerance: 1%
R70 = RL0603K001-1: as R92 on sheet Sheet1; Distributor: Future; Price: 0.0017$; Tolerance: 1%; PartNum: RC0603FR-071KL; PartName: RC0603FR-071KL
R93 R94 R103 R104 R111 R112 R115 = RL0603E100-1: 100, 1%, 0603, SMD Resistor, Taped; Manufacturer: PANASONIC; Voltage: 75 V; Tolerance: 1%; Distributor: Future; Price: 0.0017$; PartNum: ERJ-3EKF1000V; PartName: ERJ-3EKF1000V
R96-R102 = RL0603E510-1: 510 R, 1%, 0603, SMD Resistor, Taped; Manufacturer: Vishay; Voltage: 75 V; Distributor: Schukat; Price: 0.002 Euro; Tolerance: 1%; PartNum: RL0603E510-1; PartName: RL0603E510-1
R106 R107 = MCS3264R010FER: Curr.sens.res. 0.01 OHM 2W 1% , 2512 (6432 Metric); Manufacturer: Ohmite; PartNum: MCS3264R010FERCT-ND; Distributor: Digi-Key; Price: 0.3$; Tolerance: 1%; PartName: MCS3264R010FER
R108 R113 = RL0603K004.7-1: 4.7 K, 1%, 0603, SMD Resistor, Taped; Manufacturer: Vishay; Voltage: 75 V; Distributor: Schukat; Price: 0.002 Euro; Tolerance: 1%; PartNum: RL0603K004.7-1; PartName: RL0603K004.7-1
R109 R110 R114 = RL0603K010-1: as R78 on sheet Sheet1; Distributor: Digi-Key; Price: 0.016$; Tolerance: 1%
U12 U13 = MAX4080TAUA+: IC OPAMP CURR SENSE 250KHZ 8UMAX; Manufacturer: Infineon; PartNum: MAX4080TAUA+-ND; Price: 1.58$; Distributor: Rutnik; PartName: MAX4080TAUA+
U14 = TC4427ACOA: MOSFET drv 1.5A dual, 4.5-18 V,   8SOIC, 0-70 C; Manufacturer: Microchip Technology; PartNum: TC4427ACOA-ND; Distributor: Digi-Key; Price: 0.84$; PartName: TC4427ACOA
U16 = ULN2003D1013TR: TRANS 7 NPN DARL 50V 500MA 16SO; Manufacturer: STMicroelectronics; PartNum: 497-2345-1-ND; Distributor: DigiKey; Price: 0.52$; PartName: ULN2003D1013TR
U18 = MAX9943AUA+: OpAmp 2.4MHZ, 6..38V,  20 mA, 8-TSSOP; Manufacturer: Maxim Integrated Products; PartName: MAX9943AUA+-ND; Price: 1.46$; Distributor: Digi-Key; PartNum: MAX9943AUA+-ND
X15 X41 = MCV1.5/8-G-3.5: HEADER, VERTICAL, 3.5MM, 8WAY; Manufacturer: PHOENIX CONTACT; PartNum: 1843664; Distributor: Phoenix Contact; Price: 0.88 Euro; PartName: MCV 1,5/ 8-G-3,5
X18-X22 X24 X25 X27 X29 X30 X32 X40 = MCV1.5/2-G-3.5: HEADER, VERTICAL, 3.5MM, 2WAY; Manufacturer: PHOENIX CONTACT; PartNum: 1843606; Distributor: Phoenix Contact; Price: 0.22 Euro; PartName: MCV 1,5/ 2-G-3,5
X39 = MCV1.5/6-G-3.5: HEADER, VERTICAL, 3.5MM, 6WAY; Manufacturer: PHOENIX CONTACT; PartNum: 1843648; Distributor: Phoenix Contact; Price: 0.66 Euro; PartName: MCV 1,5/ 6-G-3,5
X42 X43 = MCV1.5/3-G-3.5: as X37 on sheet Sheet1; Distributor: Phoenix Contact; Price: 0.32 Euro; PartName: MCV 1,5/ 3-G-3,5

## Sheet Sheet3.SchDoc
size A3; DocumentNumber: 3; SheetNumber: 3; SheetTotal: 4
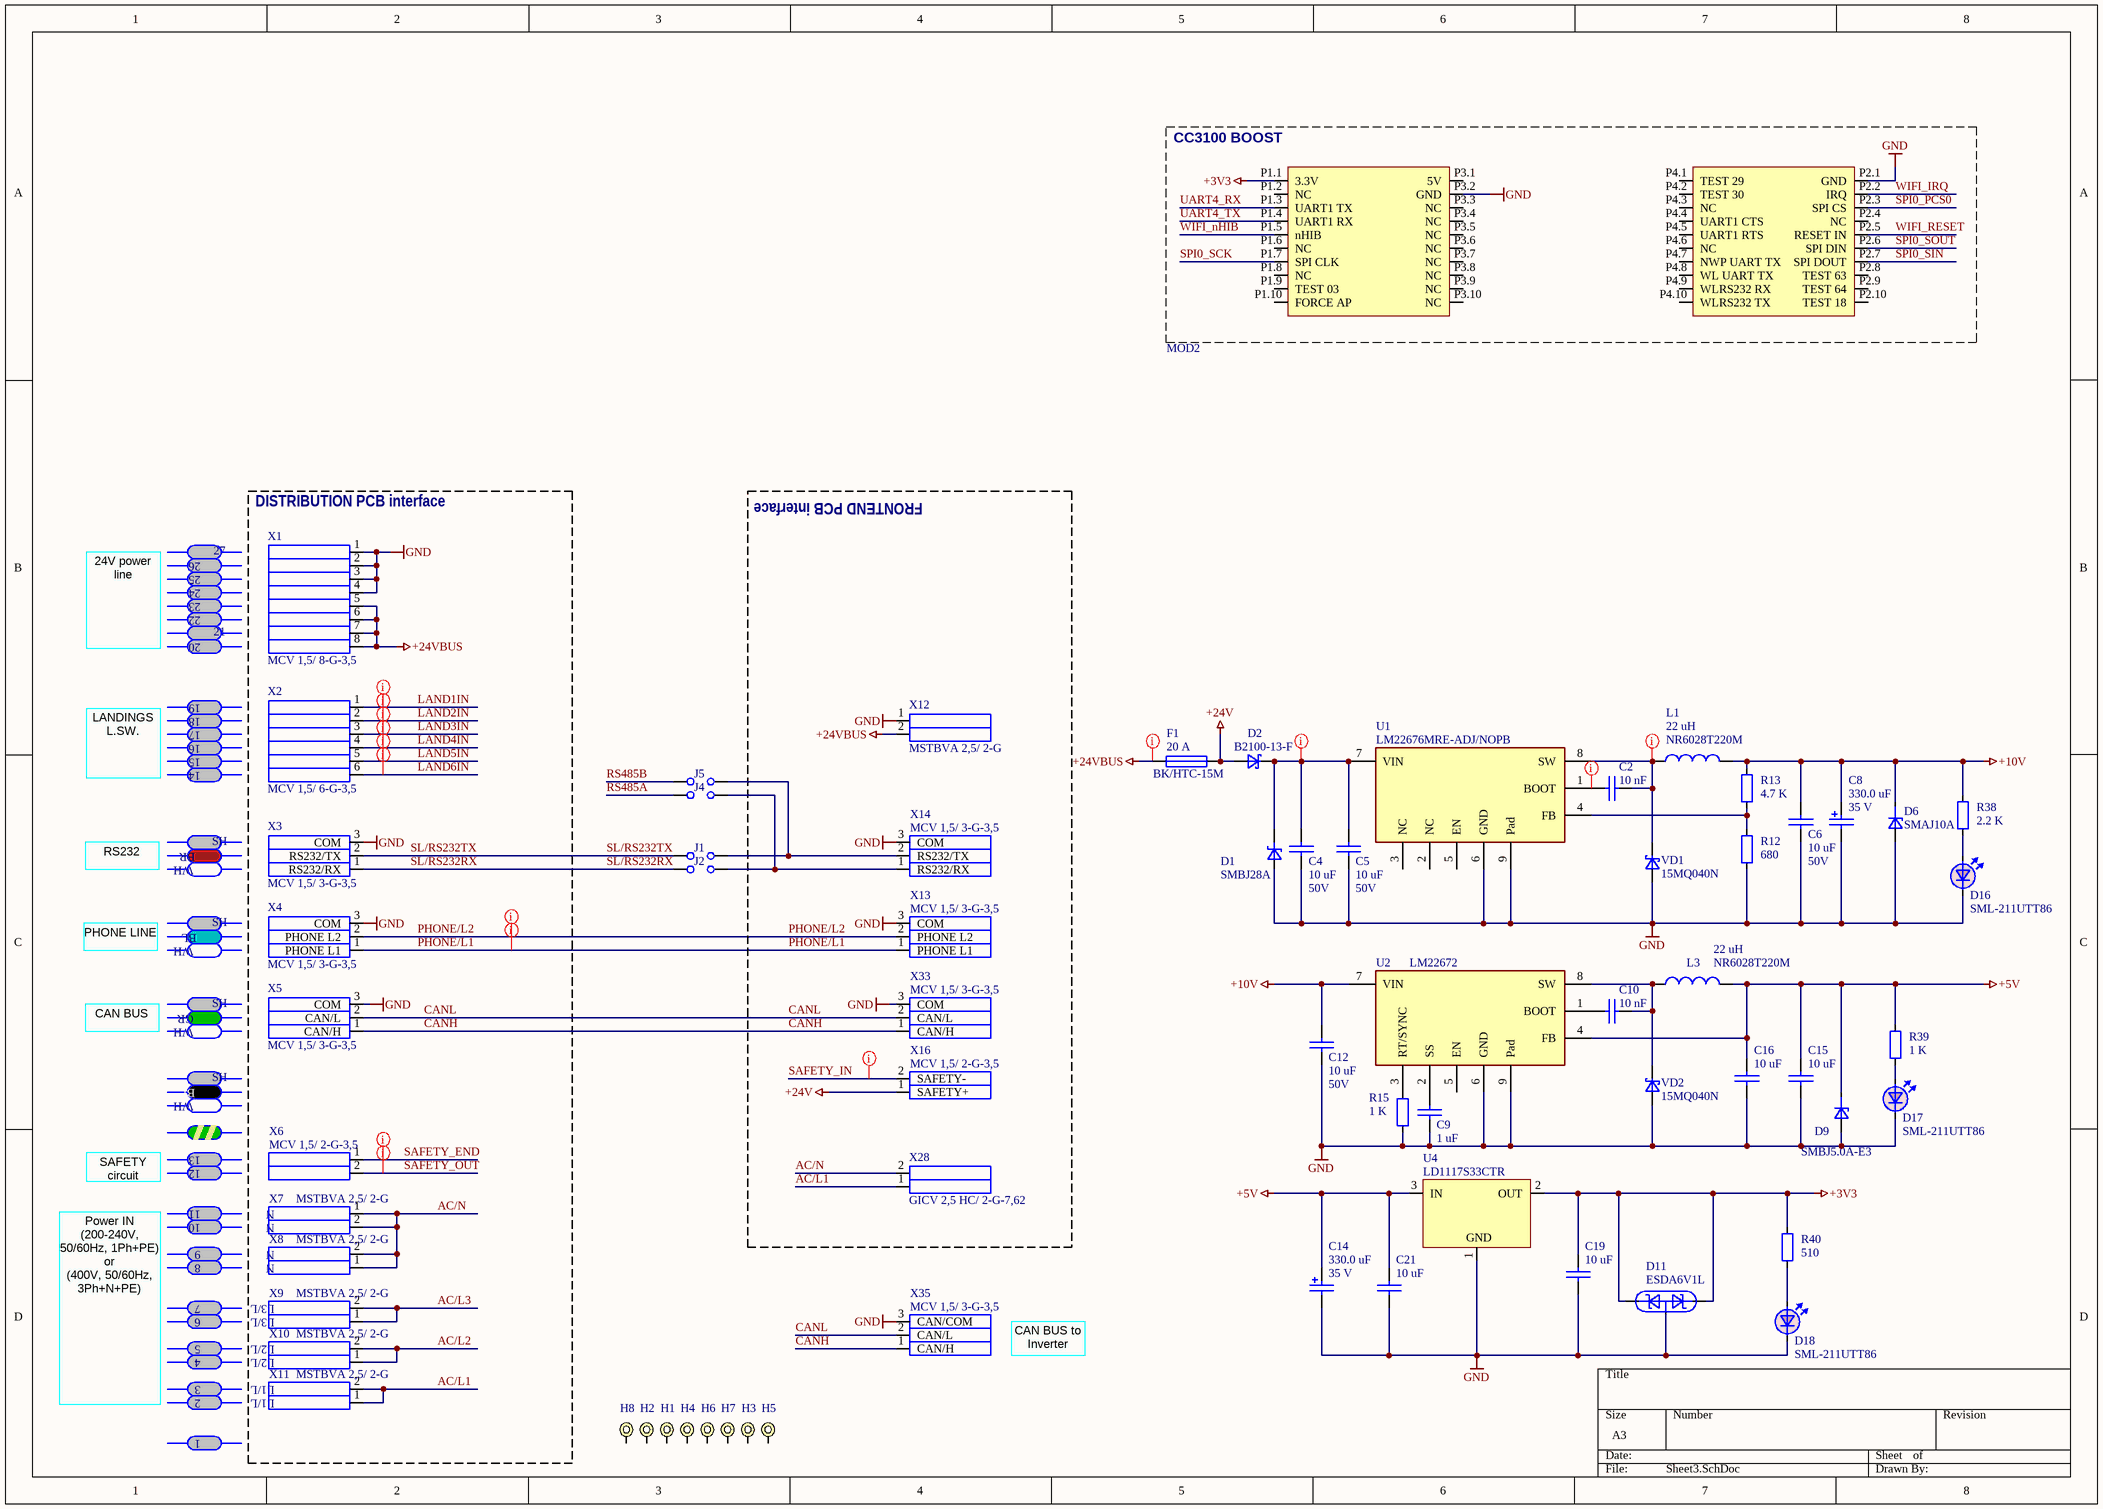
[diagram p2: Sheet3.SchDoc]

### Parts
C2  value 10 nF  [1608[0603]]  (hidden comment: CVNF010K0603)
C4  value 10 uF  Voltage: 50V  [3225[1210]]  (hidden comment: GRM32DF51H106ZA01L)
C5  value 10 uF  Voltage: 50V  [3225[1210]]  (hidden comment: GRM32DF51H106ZA01L)
C6  value 10 uF  Voltage: 50V  [3225[1210]]  (hidden comment: GRM32DF51H106ZA01L)
C8  value 330.0 uF  Voltage: 35 V  [Alum.SMD Cap. 10*10]  (hidden comment: UUD1V331MNL1GS)
C9  value 1 uF  [2012[0805]]  (hidden comment: GRM21BR71A105KA01L)
C10  value 10 nF  [1608[0603]]  (hidden comment: CVNF010K0603)
C12  value 10 uF  Voltage: 50V  [3225[1210]]  (hidden comment: GRM32DF51H106ZA01L)
C14  value 330.0 uF  Voltage: 35 V  [Alum.SMD Cap. 10*10]  (hidden comment: UUD1V331MNL1GS)
C15  value 10 uF  [0805-1206]  (hidden comment: C2012X5R1C106K085AC)
C16  value 10 uF  [0805-1206]  (hidden comment: C2012X5R1C106K085AC)
C19  value 10 uF  [0805-1206]  (hidden comment: C2012X5R1C106K085AC)
C21  value 10 uF  [0805-1206]  (hidden comment: C2012X5R1C106K085AC)
D1  SMBJ28A  [DO-214AA_SMBJ]
D2  B2100-13-F  [SMB ST]
D6  SMAJ10A  [SMA]
D9  SMBJ5.0A-E3  [DO-214AA_SMBJ]
D11  ESDA6V1L  [SOT23]
D16  SML-211UTT86  [0805 LED]
D17  SML-211UTT86  [0805 LED]
D18  SML-211UTT86  [0805 LED]
F1  BK/HTC-15M  value 20 A  [FUSE KS21SW]
H1  Hole 3MM Plated  [HOLE_3MM plated]  (value not drawn)  (no BOM)
H2  Hole 3MM Plated  [HOLE_3MM plated]  (value not drawn)  (no BOM)
H3  Hole 3MM Plated  [HOLE_3MM plated]  (value not drawn)  (no BOM)
H4  Hole 3MM Plated  [HOLE_3MM plated]  (value not drawn)  (no BOM)
H5  Hole 3MM Plated  [HOLE_3MM plated]  (value not drawn)  (no BOM)
H6  Hole 3MM Plated  [HOLE_3MM plated]  (value not drawn)  (no BOM)
H7  Hole 3MM Plated  [HOLE_3MM plated]  (value not drawn)  (no BOM)
H8  Hole 3MM Plated  [HOLE_3MM plated]  (value not drawn)  (no BOM)
J1  PH1-02-TA-HT  [HDR1X2V]  (value not drawn)
J2  PH1-02-TA-HT  [HDR1X2V]  (value not drawn)
J4  PH1-02-TA-HT  [HDR1X2V]  (value not drawn)
J5  PH1-02-TA-HT  [HDR1X2V]  (value not drawn)
L1  NR6028T220M  value 22 uH  [NR6028 yuden]
L3  NR6028T220M  value 22 uH  [NR6028 yuden]
MOD2  CC3100BOOST  [CC3100BOOST]  (value not drawn)  (no BOM)
R12  value 680  [0603]  (hidden comment: RL0603E680-1)
R13  value 4.7 K  [0603]  (hidden comment: RL0603K004.7-1)
R15  value 1 K  [0603]  (hidden comment: RC0603FR-071KL)
R38  value 2.2 K  [0603]  (hidden comment: RC0603FR-072K2L)
R39  value 1 K  [0603]  (hidden comment: RC0603FR-071KL)
R40  value 510  [0603]  (hidden comment: RL0603E510-1)
U1  LM22676MRE-ADJ/NOPB  [SOIC-8 EDP]
U2  LM22672  [SOIC-8 EDP]
U4  LD1117S33CTR  [SOT-223]
VD1  15MQ040N  [SMA]
VD2  15MQ040N  [SMA]
X1  MCV 1,5/ 8-G-3,5  [mcv1.5-8-g_3.5]
X2  MCV 1,5/ 6-G-3,5  [mcv1.5-6-g_3.5]
X3  MCV 1,5/ 3-G-3,5  [mcv1.5-3-g_3.5]
X4  MCV 1,5/ 3-G-3,5  [mcv1.5-3-g_3.5]
X5  MCV 1,5/ 3-G-3,5  [mcv1.5-3-g_3.5]
X6  MCV 1,5/ 2-G-3,5  [mcv1.5-2-g_3.5]
X7  MSTBVA 2,5/ 2-G  [CIM020P1]
X8  MSTBVA 2,5/ 2-G  [CIM020P1]
X9  MSTBVA 2,5/ 2-G  [CIM020P1]
X10  MSTBVA 2,5/ 2-G  [CIM020P1]
X11  MSTBVA 2,5/ 2-G  [CIM020P1]
X12  MSTBVA 2,5/ 2-G  [CIM020P1]
X13  MCV 1,5/ 3-G-3,5  [mcv1.5-3-g_3.5]
X14  MCV 1,5/ 3-G-3,5  [mcv1.5-3-g_3.5]
X16  MCV 1,5/ 2-G-3,5  [mcv1.5-2-g_3.5]
X28  GICV 2,5 HC/ 2-G-7,62  [1756485 GICV 2,5 HC/2 -G-7,62]
X33  MCV 1,5/ 3-G-3,5  [mcv1.5-3-g_3.5]
X35  MCV 1,5/ 3-G-3,5  [mcv1.5-3-g_3.5]

### Blocks framed on the sheet
DISTRIBUTION PCB interface: X1-X11
FRONTEND PCB interface: X12-X14 X16 X28 X33

### Nets
+3V3: C19.2 D11.1 D11.2 MOD2.P1.1(3.3V) R40.2 U4.2(OUT)
+5V: C14.1 C15.2 C16.2 C21.2 D9.1(C) L3.2 R39.2 U2.4(FB) U4.3(IN)
+10V: C6.1 C8.1 C12.1 D6.1 L1.2 R13.2 R38.2 U2.7(VIN)
+24V: D2.1(A) F1.1 X16.1(SAFETY+)
+24VBUS: F1.2 X1.5 X1.6 X1.7 X1.8 X12.2
GND: C4.2 C5.2 C6.2 C8.2 C9.1 C12.2 C14.2 C15.1 C16.1 C19.1 C21.1 D1.2(A) D6.2 D9.2(A) D11.3 D16.2 D17.2 D18.2 MOD2.P2.1(GND) MOD2.P3.2(GND) R12.1 R15.1 U1.6(GND) U1.9(Pad) U2.6(GND) U2.9(Pad) U4.1(GND) VD1.2 VD2.2 X1.1 X1.2 X1.3 X1.4 X3.3(COM) X4.3(COM) X5.3(COM) X12.1 X13.3(COM) X14.3(COM) X33.3(COM) X35.3(CAN/COM)
AC/L1: X11.1 X11.2 X28.1
AC/L2: X10.1 X10.2
AC/L3: X9.1 X9.2
AC/N: X7.1 X7.2 X8.1 X8.2 X28.2
CANH: X5.1(CAN/H) X33.1(CAN/H) X35.1(CAN/H)
CANL: X5.2(CAN/L) X33.2(CAN/L) X35.2(CAN/L)
LAND1IN: X2.1
LAND2IN: X2.2
LAND3IN: X2.3
LAND4IN: X2.4
LAND5IN: X2.5
LAND6IN: X2.6
PHONE/L1: X4.1(PHONE_L1) X13.1(PHONE_L1)
PHONE/L2: X4.2(PHONE_L2) X13.2(PHONE_L2)
RS485A: J4.1
RS485B: J5.1
SAFETY_END: X6.1
SAFETY_IN: X16.2(SAFETY-)
SAFETY_OUT: X6.2
SL/RS232RX: J2.1 X3.1(RS232/RX)
SL/RS232TX: J1.1 X3.2(RS232/TX)
SPI0_PCS0: MOD2.P2.3(SPI_CS)
SPI0_SCK: MOD2.P1.7(SPI_CLK)
SPI0_SIN: MOD2.P2.7(SPI_DOUT)
SPI0_SOUT: MOD2.P2.6(SPI_DIN)
UART4_RX: MOD2.P1.3(UART1_TX)
UART4_TX: MOD2.P1.4(UART1_RX)
WIFI_IRQ: MOD2.P2.2(IRQ)
WIFI_nHIB: MOD2.P1.5(nHIB)
WIFI_RESET: MOD2.P2.5(RESET_IN)
NetC2_1: C2.1 L1.1 U1.8(SW) VD1.1
NetC2_2: C2.2 U1.1(BOOT)
NetC4_1: C4.1 C5.1 D1.1(C) D2.2(C) U1.7(VIN)
NetC9_2: C9.2 U2.2(SS)
NetC10_1: C10.1 L3.1 U2.8(SW) VD2.1
NetC10_2: C10.2 U2.1(BOOT)
NetD16_1: D16.1 R38.1
NetD17_1: D17.1 R39.1
NetD18_1: D18.1 R40.1
NetJ1_2: J1.2 J5.2 X14.2(RS232/TX)
NetJ2_2: J2.2 J4.2 X14.1(RS232/RX)
NetR12_2: R12.2 R13.1 U1.4(FB)
NetR15_2: R15.2 U2.3(RT/SYNC)

Not connected (* = marked no-connect by the designer): H1 0; H2 0; H3 0; H4 0; H5 0; H6 0; H7 0; H8 0; MOD2 P1.2(NC) P1.6(NC) P1.8(NC) P1.9(TEST_03) P1.10(FORCE_AP) P2.4(NC) P2.8(TEST_63) P2.9(TEST_64) P2.10(TEST_18) P3.1(5V) P3.3(NC) P3.4(NC) P3.5(NC) P3.6(NC) P3.7(NC) P3.8(NC) P3.9(NC) P3.10(NC) P4.1(TEST_29) P4.2(TEST_30) P4.3(NC) P4.4(UART1_CTS) P4.5(UART1_RTS) P4.6(NC) P4.7(NWP_UART_TX) P4.8(WL_UART_TX) P4.9(WLRS232_RX) P4.10(WLRS232_TX); U1 2(NC) 3(NC) 5(EN); U2 5(EN)

### Layout directives
net class 24V: +24VBUS, LAND1IN, LAND2IN, LAND3IN, LAND4IN, LAND5IN, LAND6IN, NetC2_1, NetC2_2, NetC4_1, SAFETY_END, SAFETY_IN, SAFETY_OUT
net class 100V: PHONE/L1, PHONE/L2

### Notes on the sheet
- 26
- 25
- 24
- 27
- 24V power line
- 23
- 22
- 20
- 21
- 19
- 18
- 17
- LANDINGS L.SW.
- 16
- 15
- 14
- WH
- BR
- SH
- RS232
- PHONE LINE
- BL
- CAN BUS
- GR
- SAFETY circuit
- 13
- 12
- 11
- 10
- 9
- 8
- N
- 7
- 6
- L3/L
- 5
- 4
- 3
- 2
- L1/L
- L2/L
- CAN BUS to Inverter
- Power IN (200-240V, 50/60Hz, 1Ph+PE)
  or
  (400V, 50/60Hz, 3Ph+N+PE)
- 1
- (in symbol CC3100BOOST) CC3100 BOOST

### Library data of the parts
C2 C10 = CVNF010K0603: 10 nF, 50V, 10%, X7R, 0603 SMD MLC Capacitor; Manufacturer: Murata Electronics; PartNum: 490-1512-1-ND; PartName: GRM188R71H103KA01D; Tolerance: +-10%; Distributor: Digi-Key; Price: 0.006$; Voltage: 50 V
C4-C6 C12 = GRM32DF51H106ZA01L: as C86 on sheet Sheet2; Tolerance: 20%; Price: 0.16$; Distributor: Digi-Key
C8 C14 = UUD1V331MNL1GS: Low ESR SMD alum.el.capacitor 35V, 330uF, 90 mOhm, 670 mA, 10x10, -50...+105 C; Manufacturer: Nichicon; PartNum: 493-2293-1-ND; Tolerance: 20%; Distributor: Digi-Key; Price: 1.1$; PartName: UUD1V331MNL1GS
C9 = GRM21BR71A105KA01L: 1 uF, 10V, 10%, X7R, 0805; Manufacturer: Murata; PartNum: 311-1458-1-ND; PartName: CC0805KKX7R6BB105; Tolerance: 10%; Price: 0.02$; Distributor: Mouser; Voltage: 10 V
C15 C16 C19 C21 = LMK212F106ZG-T: 10 uF, 16V, X5R, ±10%, 0805; Manufacturer: Taiyo Yuden; Distributor: Digi-Key; Price: 0.0347 Euro; Tolerance: ±10%; PartNum: C2012X5R1C106K085AC; Voltage: 16V; PartName: C2012X5R1C106K085AC
D1 = SMBJ28A: DIODE TVS 28V 600W UNI 5% SMD; Manufacturer: Littelfuse; PartNum: SMBJ28ABCT-ND; Distributor: DigiKey; Price: 0.18$; PartName: SMBJ28A; Value: 28 V
D2 = B2100-13-F: as D39 on sheet Sheet2; Price: 0.31$; Distributor: Digi-Key; PartName: B2100-13-F
D6 = SMAJ10A: DIODE TVS 28V 400W UNI 5% SMD; Manufacturer: Bourns Inc.; PartNum: SMAJ10ABCT-ND; Value: 10V; Distributor: Digi-Key; Price: 0.21$; PartName: SMAJ10A
D9 = SMBJ5.0A-E3: TVS 600W 5.0V Unidirect; Manufacturer: Vishay/General Semiconductor; PartNum: SMBJ5.0A-E3/52GICT-ND; Distributor: Digi-Key; Price: 0.23$; PartName: SMBJ5.0A-E3
D11 = ESDA6V1L: as D15 on sheet Sheet2; Distributor: Digi-Key; Price: 0.23$
D16-D18 = SML-211UTT86: as D32 on sheet Sheet2; Distributor: Digi-Key; Price: 0.34$; Value: Red; PartName: SML-211UTT86
F1 = BK/HTC-15M: FUSE HOLDER KS21SW; Manufacturer: Cooper/Bussmann; PartNum: 283-2923-ND; Distributor: Digi-Key; Price: 0.74$; PartName: BK/HTC-15M
J1 J2 J4 J5 = Jumper: as J3 on sheet Sheet1; Distributor: Future; Price: 0.02 Euro; PartNum: PH1-02-TA-HT; PartName: PH1-02-TA-HT
L1 L3 = NR6028T220M: 22uH, 1.3 A, 0.175 Ohms, +-20%,- 25 C to + 120 C; Manufacturer: Taiyo Yuden; PartNum: 587-2103-1-ND; Tolerance: ±20%; Distributor: Digi-Key; Price: 0.29$; PartName: NR6028T220M
R12 = RL0603E680-1: 680 R, 1%, 0603, SMD Resistor, Taped; Manufacturer: Vishay; Voltage: 75 V; Distributor: Schukat; Price: 0.002 Euro; Tolerance: 1%; PartNum: RL0603E680-1; PartName: RL0603E680-1
R13 = RL0603K004.7-1: as R108 on sheet Sheet2; Distributor: Schukat; Price: 0.002 Euro; Tolerance: 1%; PartNum: RL0603K004.7-1; PartName: RL0603K004.7-1
R15 R39 = RL0603K001-1: as R92 on sheet Sheet1; Distributor: Future; Price: 0.0017$; Tolerance: 1%; PartNum: RC0603FR-071KL; PartName: RC0603FR-071KL
R38 = RL0603K002.2-1: 2.2 K, 1%, 0603, SMD Resistor, Taped; Manufacturer: YAGEO AMERICA CORPORATION; Voltage: 75 V; Distributor: Future; Price: 0.0017$; Tolerance: 1%; PartNum: RC0603FR-072K2L; PartName: RC0603FR-072K2L
R40 = RL0603E510-1: as R96 on sheet Sheet2; Distributor: Schukat; Price: 0.002 Euro; Tolerance: 1%; PartNum: RL0603E510-1; PartName: RL0603E510-1
U1 = LM22676MRE-ADJ/NOPB: IC REG SWITCH BUCK 3A ADJ 8PSOP; Manufacturer: National Semiconductor; PartNum: LM22676MRE-ADJCT-ND; Price: 4.38$; Distributor: Digi-Key; PartName: LM22676MRE-ADJ/NOPB
U2 = LM22672MRE-5.0: SIMPLESWITCH, 1.0A 4.5~42VIN, 8PSOP; Manufacturer: National Semiconductor; PartNum: LM22672MRE-5.0CT-ND; PartName: LM22672MRE-5.0/NOPB; Price: 4.09$; Distributor: Digi-Key
U4 = LD1117S33CTR: Low drop positive voltage regulator, 3.3 V, 1A, SOT-223; Manufacturer: STMicroelectronics; PartNum: 497-1241-1-ND; Distributor: Digi-Key; Price: 0.59$; PartName: LD1117S33CTR
VD1 VD2 = 15MQ040N: Schottky Power Rectifier 3A, 40V, SMA; Manufacturer: VISHAY; Price: 0.8; Distributor: TME; PartNum: 15MQ040N; PartName: 15MQ040N
X1 = MCV1.5/8-G-3.5: as X15 on sheet Sheet2; Distributor: Phoenix Contact; Price: 0.88 Euro; PartName: MCV 1,5/ 8-G-3,5
X2 = MCV1.5/6-G-3.5: as X39 on sheet Sheet2; Distributor: Phoenix Contact; Price: 0.66 Euro; PartName: MCV 1,5/ 6-G-3,5
X3-X5 X13 X14 X33 X35 = MCV1.5/3-G-3.5: as X37 on sheet Sheet1; Distributor: Phoenix Contact; Price: 0.32 Euro; PartName: MCV 1,5/ 3-G-3,5
X6 X16 = MCV1.5/2-G-3.5: as X18 on sheet Sheet2; Distributor: Phoenix Contact; Price: 0.22 Euro; PartName: MCV 1,5/ 2-G-3,5
X7-X12 = 796636-2: TERM BLOCK HEADER 2POS 5.08MM; Manufacturer: Phoenix Contact; PartNum: 1755516; Distributor: Phoenix Contact; Price: 0.204 Euro; PartName: MSTBVA 2,5/ 2-G
X28 = GICV 2,5 HC/ 2-G-7,62: Header, Nominal current: 16 A, Rated voltage (III/2): 630 V, Number of positions: 2, Pitch: 7.62 mm, Color: green; Manufacturer: PHOENIX CONTACT; PartNum: 1756485; Distributor: PHOENIX CONTACT; Price: 0.66 Euro; PartName: GICV 2,5 HC/ 2-G-7,62